# EAGLE design obd2can (EAGLE 7.2.0)
DESCRIPTION: microOBD 200 OBD-II Module; HW_REV: 1.4; PCB_REV: C; PCB_SPEC1: Layer Count: 4; PCB_SPEC2: Size: 1.3" x 0.59"; PCB_SPEC3: Finish Thickness: 0.049" - 0.052"; PCB_SPEC4: Copper Weight: 1oz; TITLE: STM1120

## Sheet 1 of 4
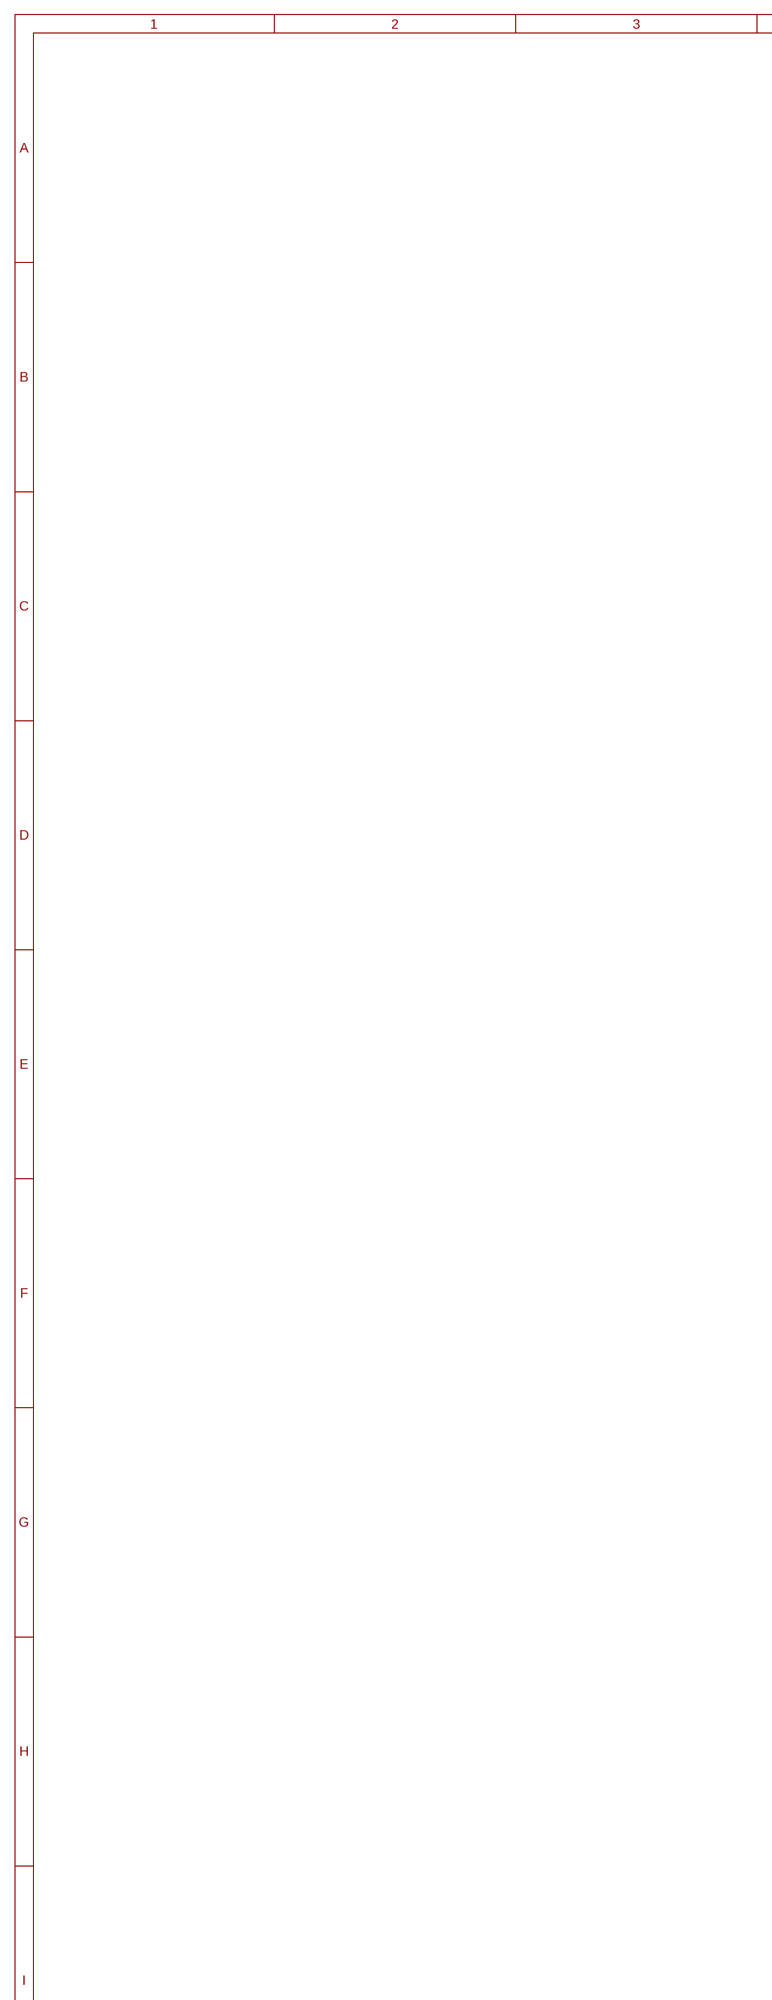
[diagram p0: schematic, sheet 1, part 1 of 2]
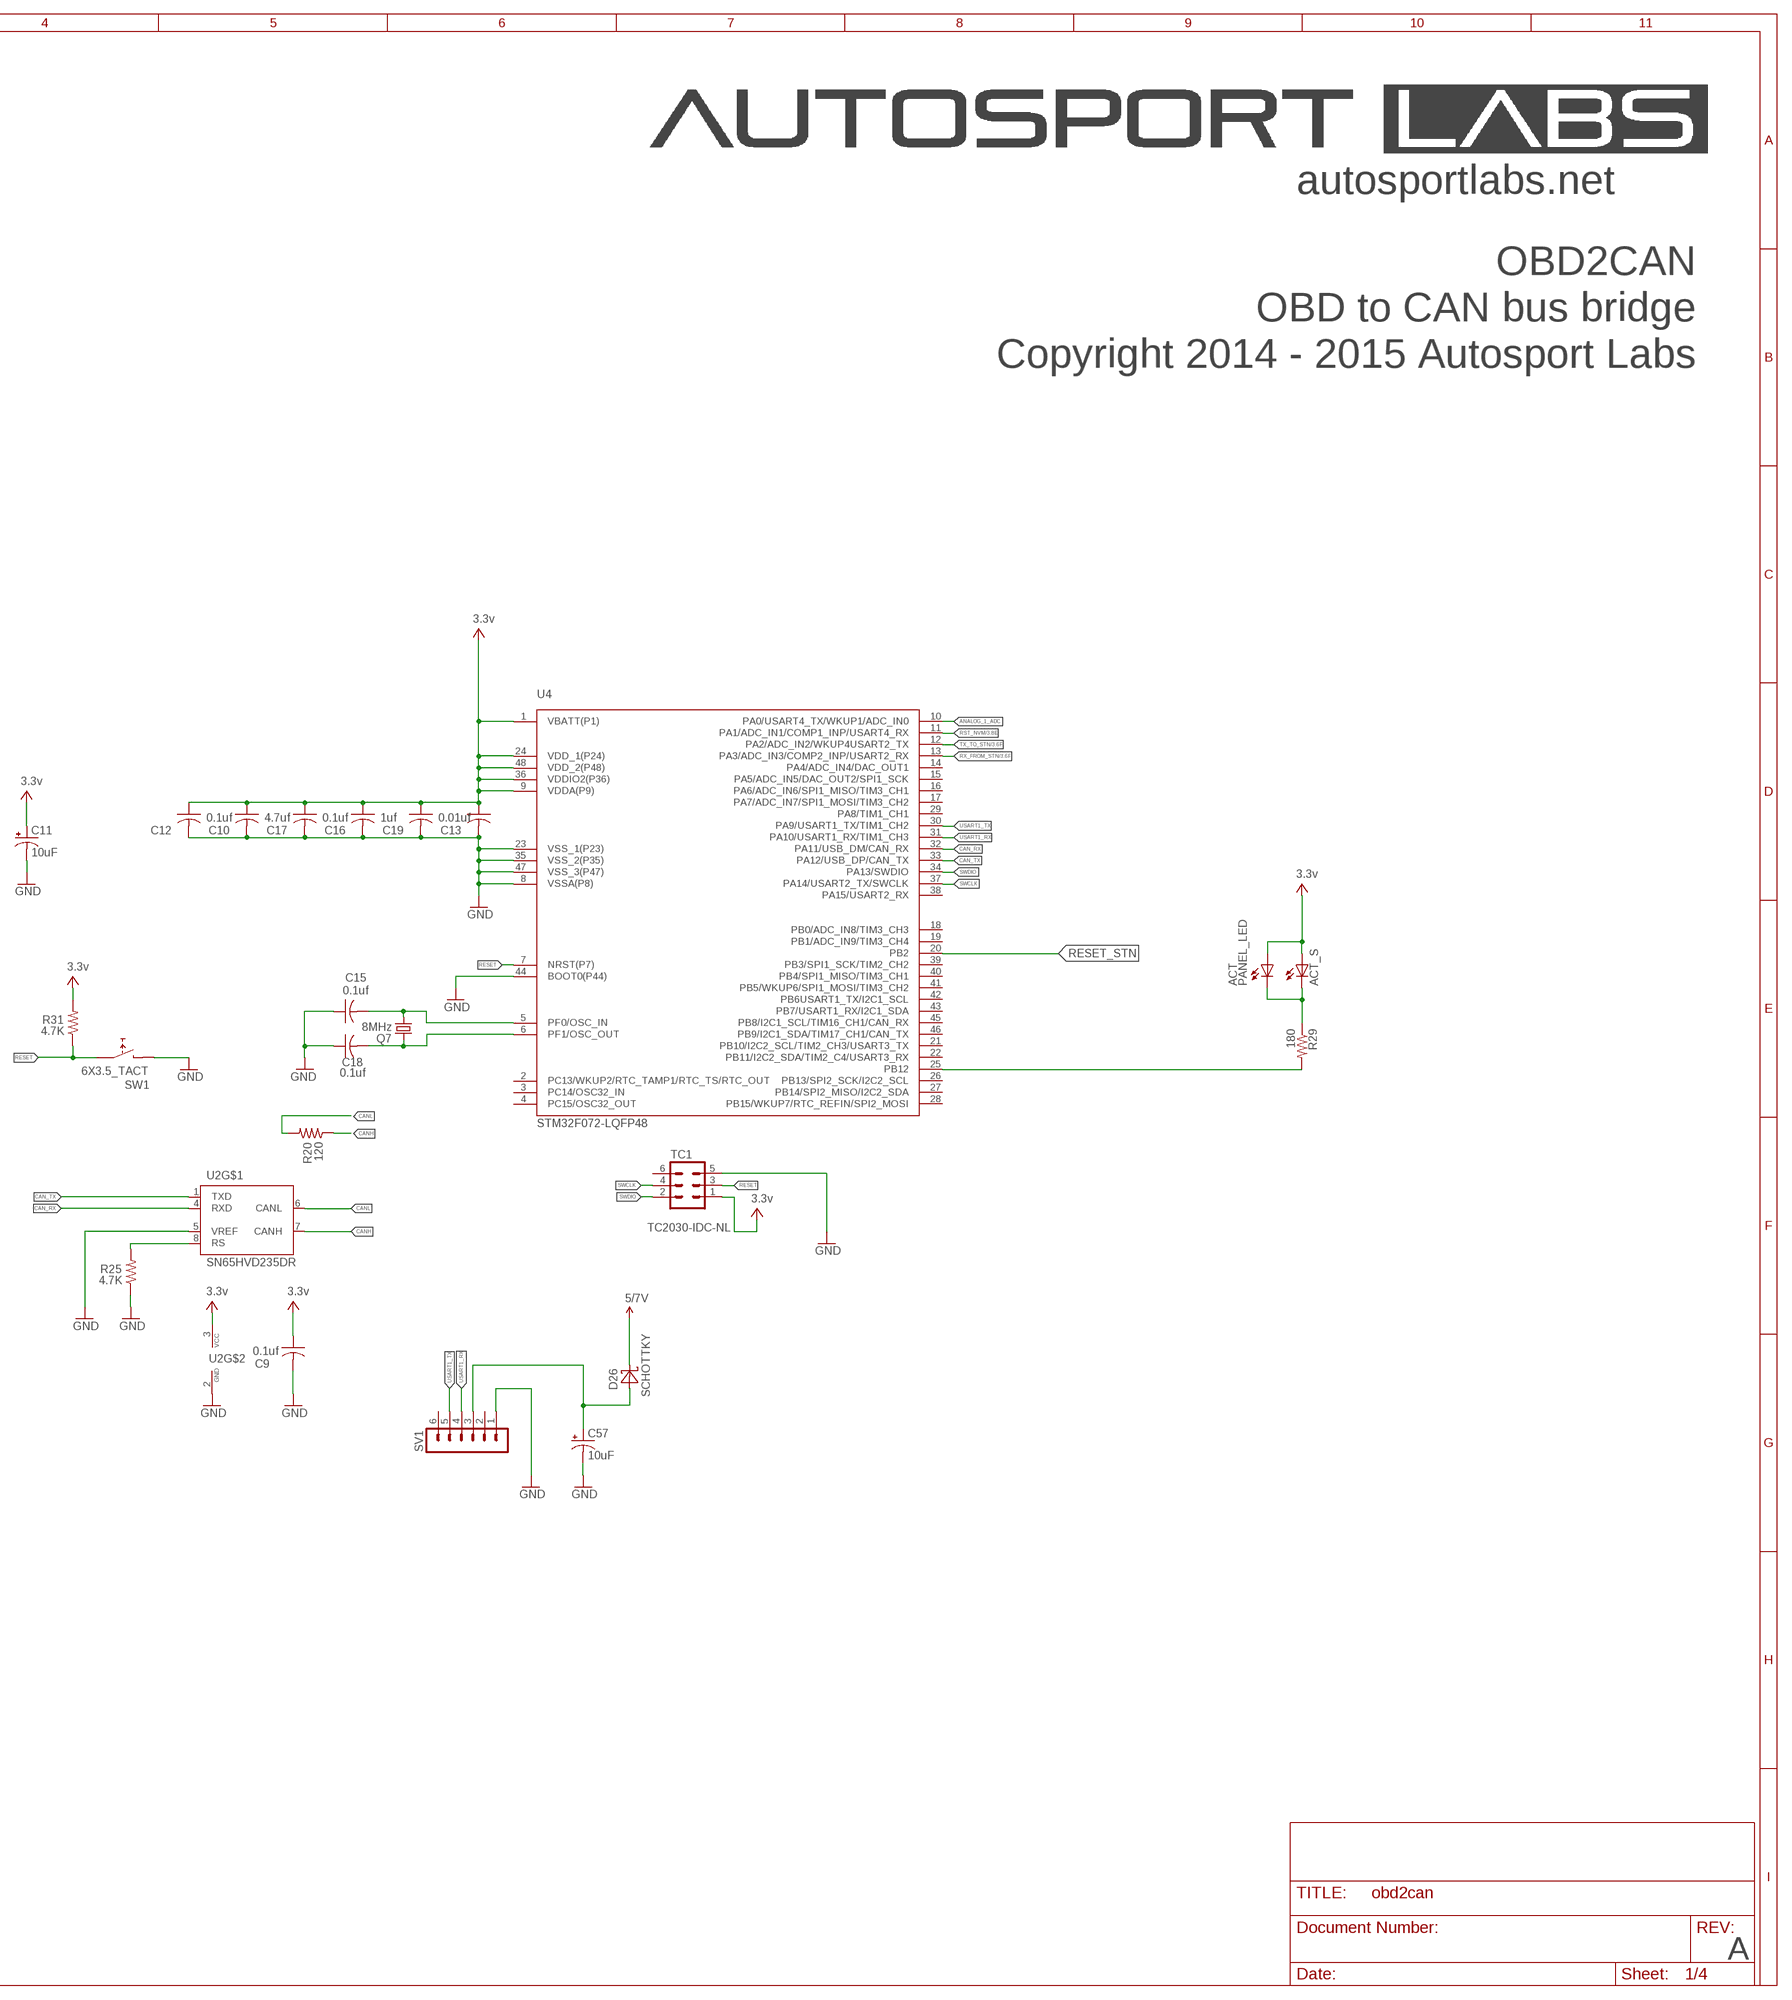
[diagram p1: schematic, sheet 1, part 2 of 2]

### Parts
ACT  PANEL_LED  [RIGHTANGLE_CML_5323F5]
ACT_S  LEDCHIPLED_0603  [CHIPLED_0603]
C9  0.1uf  C-USC0603K  [C0603K]
C10  0.1uf  C-USC0603K  [C0603K]
C11  10uF  CPOL-USSMCA  [SMC_A]
C12  4.7uf  C-USC0603K  [C0603K]
C13  0.01uf  C-USC0603K  [C0603K]
C15  0.1uf  C-USC0603K  [C0603K]
C16  0.1uf  C-USC0603K  [C0603K]
C17  4.7uf  C-USC0603K  [C0603K]
C18  0.1uf  C-USC0603K  [C0603K]
C19  1uf  C-USC0603K  [C0603K]
C57  10uF  CPOL-USSMCA  [SMC_A]
D26  SCHOTTKY  [SMA]
Q7  8MHz  CRYSTAL5X3  [CRYSTAL-SMD-5X3]
R20  120  R-US_R0603  [R0603]
R25  4.7K  R-US_R0603  [R0603]
R29  180  RESISTOR0402-RES  [0402-RES]
R31  4.7K  R-US_R0603  [R0603]
SV1  MA06-1  [MA06-1]
SW1  6X3.5_TACT  [TACT_6X3.5]
TC1  TC2030-IDC-NL  [TC2030-IDC-NL]
U2  SN65HVD235DR  MCP2551SO8  [SO08]
U4  STM32F072-LQFP48  [LQFP48]

### Nets
ANALOG_1_ADC: U4.10(PA0/USART4_TX/WKUP1/ADC_IN0)
CAN_RX: U2.4(RXD) U4.32(PA11/USB_DM/CAN_RX)
CAN_TX: U2.1(TXD) U4.33(PA12/USB_DP/CAN_TX)
CANH: R20.1 U2.7(CANH) ; also sheet 2
CANL: R20.2 U2.6(CANL) ; also sheet 2
GND: C9.2 C10.2 C11.- C12.2 C13.2 C15.1 C16.2 C17.2 C18.1 C19.2 C57.- R25.1 SV1.1 SW1.P$2 TC1.5 U2.2(GND) U2.5(VREF) U4.8(VSSA(P8)) U4.23(VSS_1(P23)) U4.35(VSS_2(P35)) U4.44(BOOT0(P44)) U4.47(VSS_3(P47)) ; also sheet 2,3,4
GND1: ACT.C ACT_S.C R29.1
N$11: R29.2 U4.25(PB12)
N$15: R25.2 U2.8(RS)
N$40: C18.2 Q7.3 U4.6(PF1/OSC_OUT)
N$42: C15.2 Q7.1 U4.5(PF0/OSC_IN)
RESET: R31.1 SW1.P$1 TC1.3 U4.7(NRST(P7))
RESET_STN: U4.20(PB2) ; also sheet 3
RST_NVM: U4.11(PA1/ADC_IN1/COMP1_INP/USART4_RX) ; also sheet 3
RX_FROM_STN: U4.13(PA3/ADC_IN3/COMP2_INP/USART2_RX) ; also sheet 3
SWCLK: TC1.4 U4.37(PA14/USART2_TX/SWCLK)
SWDIO: TC1.2 U4.34(PA13/SWDIO)
TX_TO_STN: U4.12(PA2/ADC_IN2/WKUP4USART2_TX) ; also sheet 3
USART1_RX: SV1.4 U4.31(PA10/USART1_RX/TIM1_CH3)
USART1_TX: SV1.5 U4.30(PA9/USART1_TX/TIM1_CH2)
V+: ACT.A ACT_S.A C9.1 C10.1 C11.+ C12.1 C13.1 C16.1 C17.1 C19.1 R31.2 TC1.1 U2.3(VCC) U4.1(VBATT(P1)) U4.9(VDDA(P9)) U4.24(VDD_1(P24)) U4.36(VDDIO2(P36)) U4.48(VDD_2(P48)) ; supply symbol labelled 3.3v ; also sheet 2,3,4
VBUS: C57.+ D26.A SV1.3
VCC: D26.C ; supply symbol labelled 5/7V ; also sheet 2,4
Unconnected: SV1.2 SV1.6 TC1.6 U4.2(PC13/WKUP2/RTC_TAMP1/RTC_TS/RTC_OUT) U4.3(PC14/OSC32_IN) U4.4(PC15/OSC32_OUT) U4.14(PA4/ADC_IN4/DAC_OUT1) U4.15(PA5/ADC_IN5/DAC_OUT2/SPI1_SCK) U4.16(PA6/ADC_IN6/SPI1_MISO/TIM3_CH1) U4.17(PA7/ADC_IN7/SPI1_MOSI/TIM3_CH2) U4.18(PB0/ADC_IN8/TIM3_CH3) U4.19(PB1/ADC_IN9/TIM3_CH4) U4.21(PB10/I2C2_SCL/TIM2_CH3/USART3_TX) U4.22(PB11/I2C2_SDA/TIM2_C4/USART3_RX) U4.26(PB13/SPI2_SCK/I2C2_SCL) U4.27(PB14/SPI2_MISO/I2C2_SDA) U4.28(PB15/WKUP7/RTC_REFIN/SPI2_MOSI) U4.29(PA8/TIM1_CH1) U4.38(PA15/USART2_RX) U4.39(PB3/SPI1_SCK/TIM2_CH2) U4.40(PB4/SPI1_MISO/TIM3_CH1) U4.41(PB5/WKUP6/SPI1_MOSI/TIM3_CH2) U4.42(PB6USART1_TX/I2C1_SCL) U4.43(PB7/USART1_RX/I2C1_SDA) U4.45(PB8/I2C1_SCL/TIM16_CH1/CAN_RX) U4.46(PB9/I2C1_SDA/TIM17_CH1/CAN_TX)

### Notes on the sheet
- autosportlabs.net
- OBD2CAN
- OBD to CAN bus bridge
- Copyright 2014 - 2015 Autosport Labs
- A

## Sheet 2 of 4
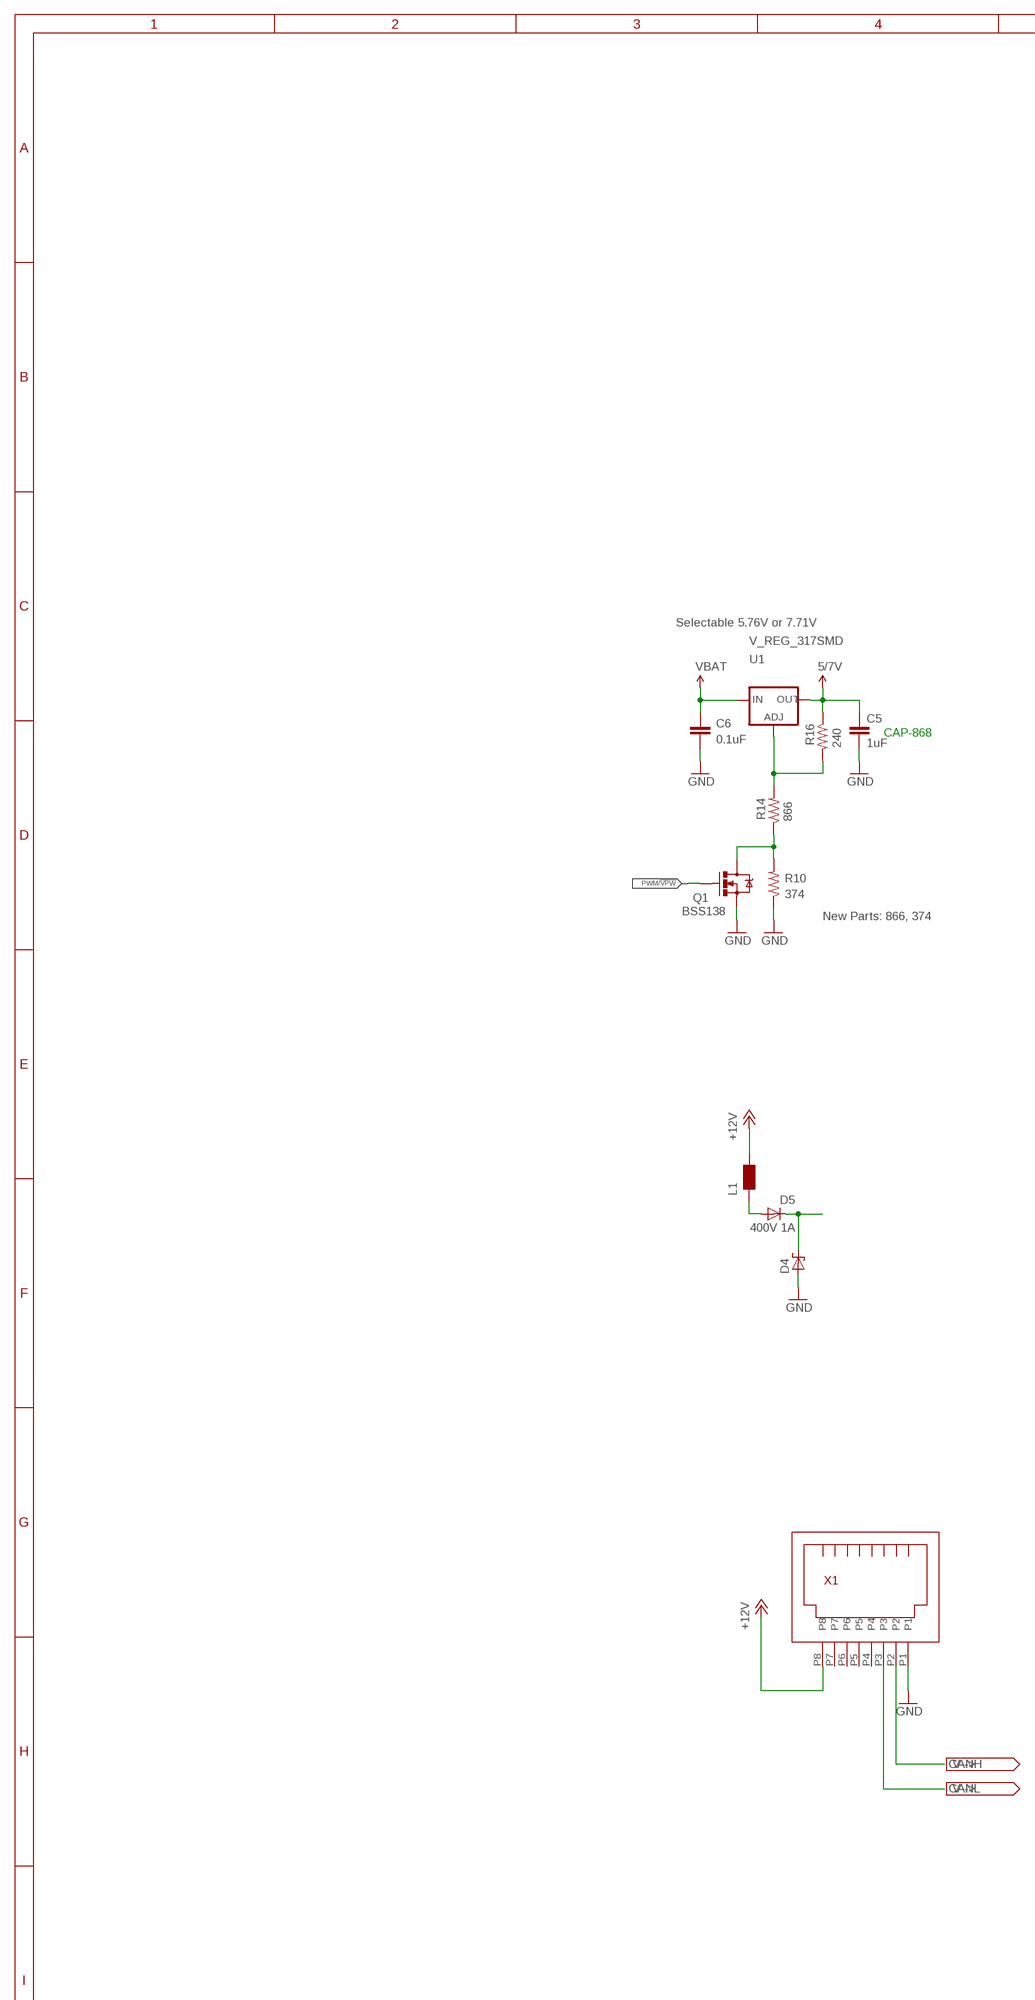
[diagram p2: schematic, sheet 2, part 1 of 2]
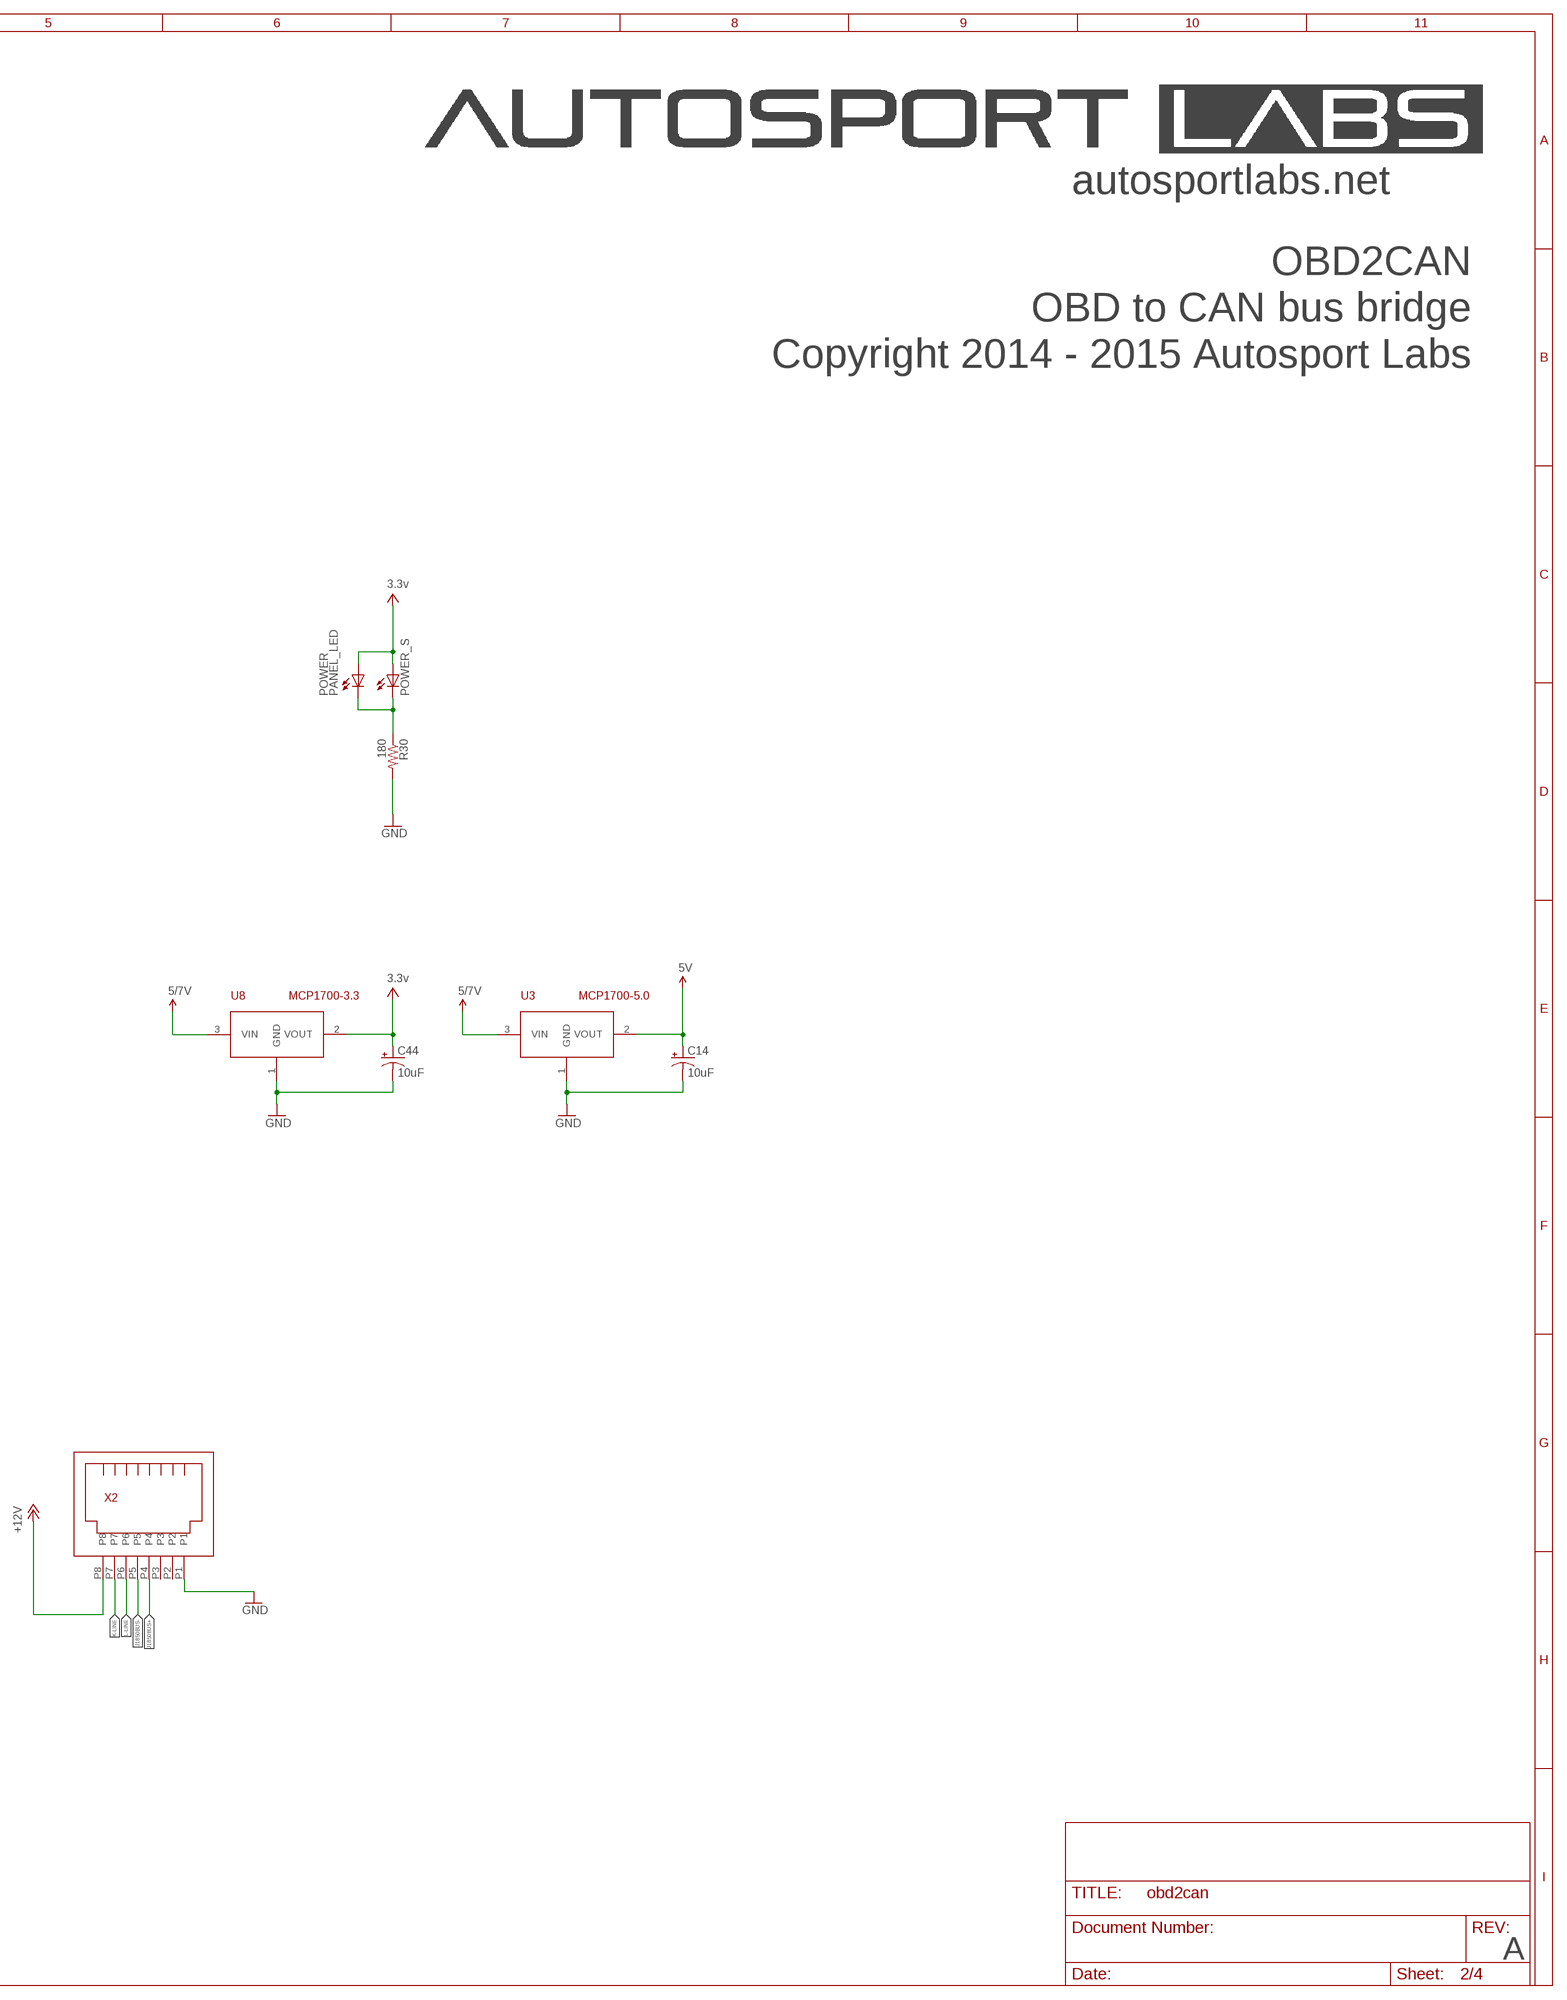
[diagram p3: schematic, sheet 2, part 2 of 2]

### Parts
C5  1uF  CAP0402-CAP  [0402-CAP]
C6  0.1uF  CAP0402-CAP  [0402-CAP]
C14  10uF  CPOL-USSMCA  [SMC_A]
C44  10uF  CPOL-USSMCA  [SMC_A]
D4  SCHOTTKY-DIODESMC  [SMC]
D5  400V 1A  DIODE1  [SMA]
L1  WE-CBF_1812  [1812]
POWER  PANEL_LED  [RIGHTANGLE_CML_5323F5]
POWER_S  LEDCHIPLED_0603  [CHIPLED_0603]
Q1  BSS138  MOSFET-NCHANNELSMD  [SOT23-3]
R10  374  RESISTOR0402-RES  [0402-RES]
R14  866  RESISTOR0402-RES  [0402-RES]
R16  240  RESISTOR0402-RES  [0402-RES]
R30  180  RESISTOR0402-RES  [0402-RES]
U1  V_REG_317SMD  [SOT223]
U3  MCP1700-5.0  MCP1700  [SOT-23]
U8  MCP1700-3.3  MCP1700  [SOT-23]
X1  RJ45_RIGHT_ANGLEMOLEX_95001-2881  [RJ45_RIGHT_ANGLE_MOLEX_95001-2881]
X2  RJ45_RIGHT_ANGLEMOLEX_95001-2881  [RJ45_RIGHT_ANGLE_MOLEX_95001-2881]

### Nets
5V: C14.+ U3.2(VOUT) ; also sheet 4
+12V: L1.2 X1.P8 X2.P8 ; also sheet 3
CANH: X1.P2 ; also sheet 1
CANL: X1.P3 ; also sheet 1
GND: C5.2 C6.2 C14.- C44.- D4.A Q1.2(S) R10.1 R30.2 U3.1(GND) U8.1(GND) X1.P1 X2.P1 ; also sheet 1,3,4
GND2: POWER.C POWER_S.C R30.1
J1850BUS+: X2.P4 ; also sheet 4
J1850BUS-: X2.P5 ; also sheet 4
K-LINE: X2.P7 ; also sheet 4
L-LINE: X2.P6 ; also sheet 4
N$8: R14.2 R16.2 U1.1(ADJ)
N$22: Q1.3(D) R10.2 R14.1
N$50: D5.A L1.1
PWM/!VPW: Q1.1(G) ; also sheet 3
SAFE12V: C6.1 D4.C D5.C U1.3(IN) ; supply symbol labelled VBAT ; also sheet 4
V+: C44.+ POWER.A POWER_S.A U8.2(VOUT) ; supply symbol labelled 3.3v ; also sheet 1,3,4
VCC: C5.1 R16.1 U1.2(OUT) U3.3(VIN) U8.3(VIN) ; supply symbol labelled 5/7V ; also sheet 1,4
Unconnected: X1.P4 X1.P5 X1.P6 X1.P7 X2.P2 X2.P3

### Notes on the sheet
- autosportlabs.net
- OBD2CAN
- OBD to CAN bus bridge
- Copyright 2014 - 2015 Autosport Labs
- Selectable 5.76V or 7.71V
- CAP-868
- New Parts: 866, 374
- A

## Sheet 3 of 4
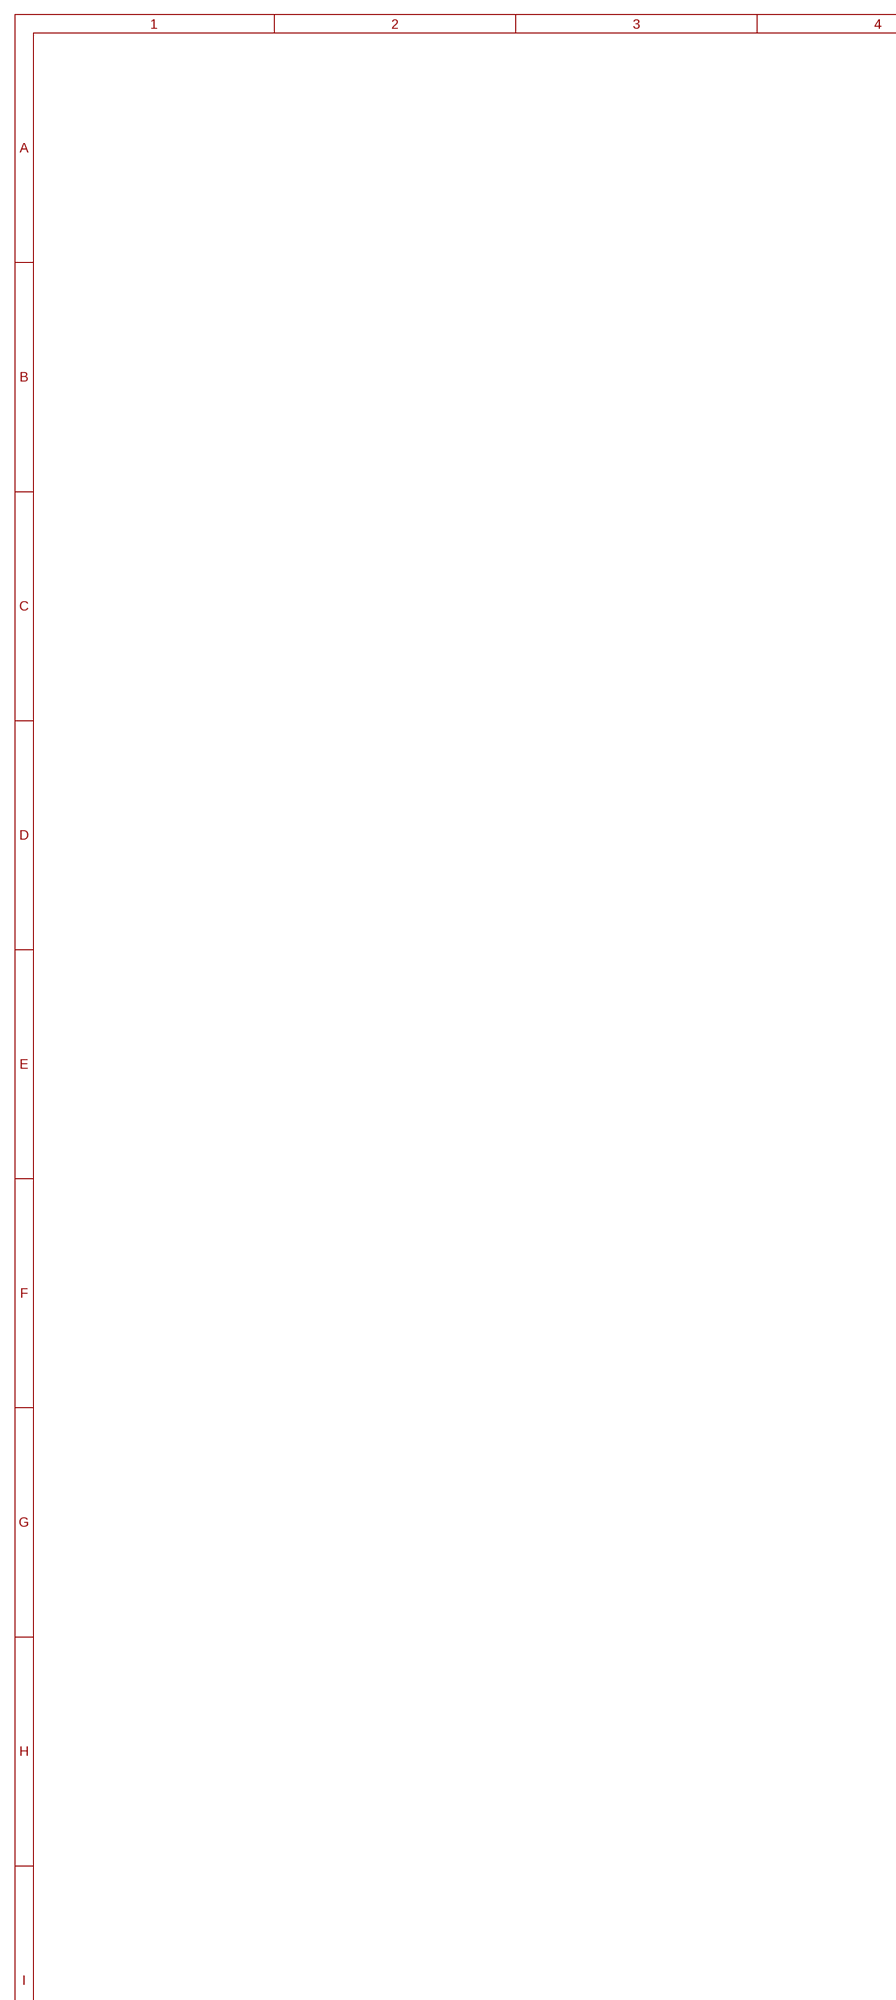
[diagram p4: schematic, sheet 3, part 1 of 2]
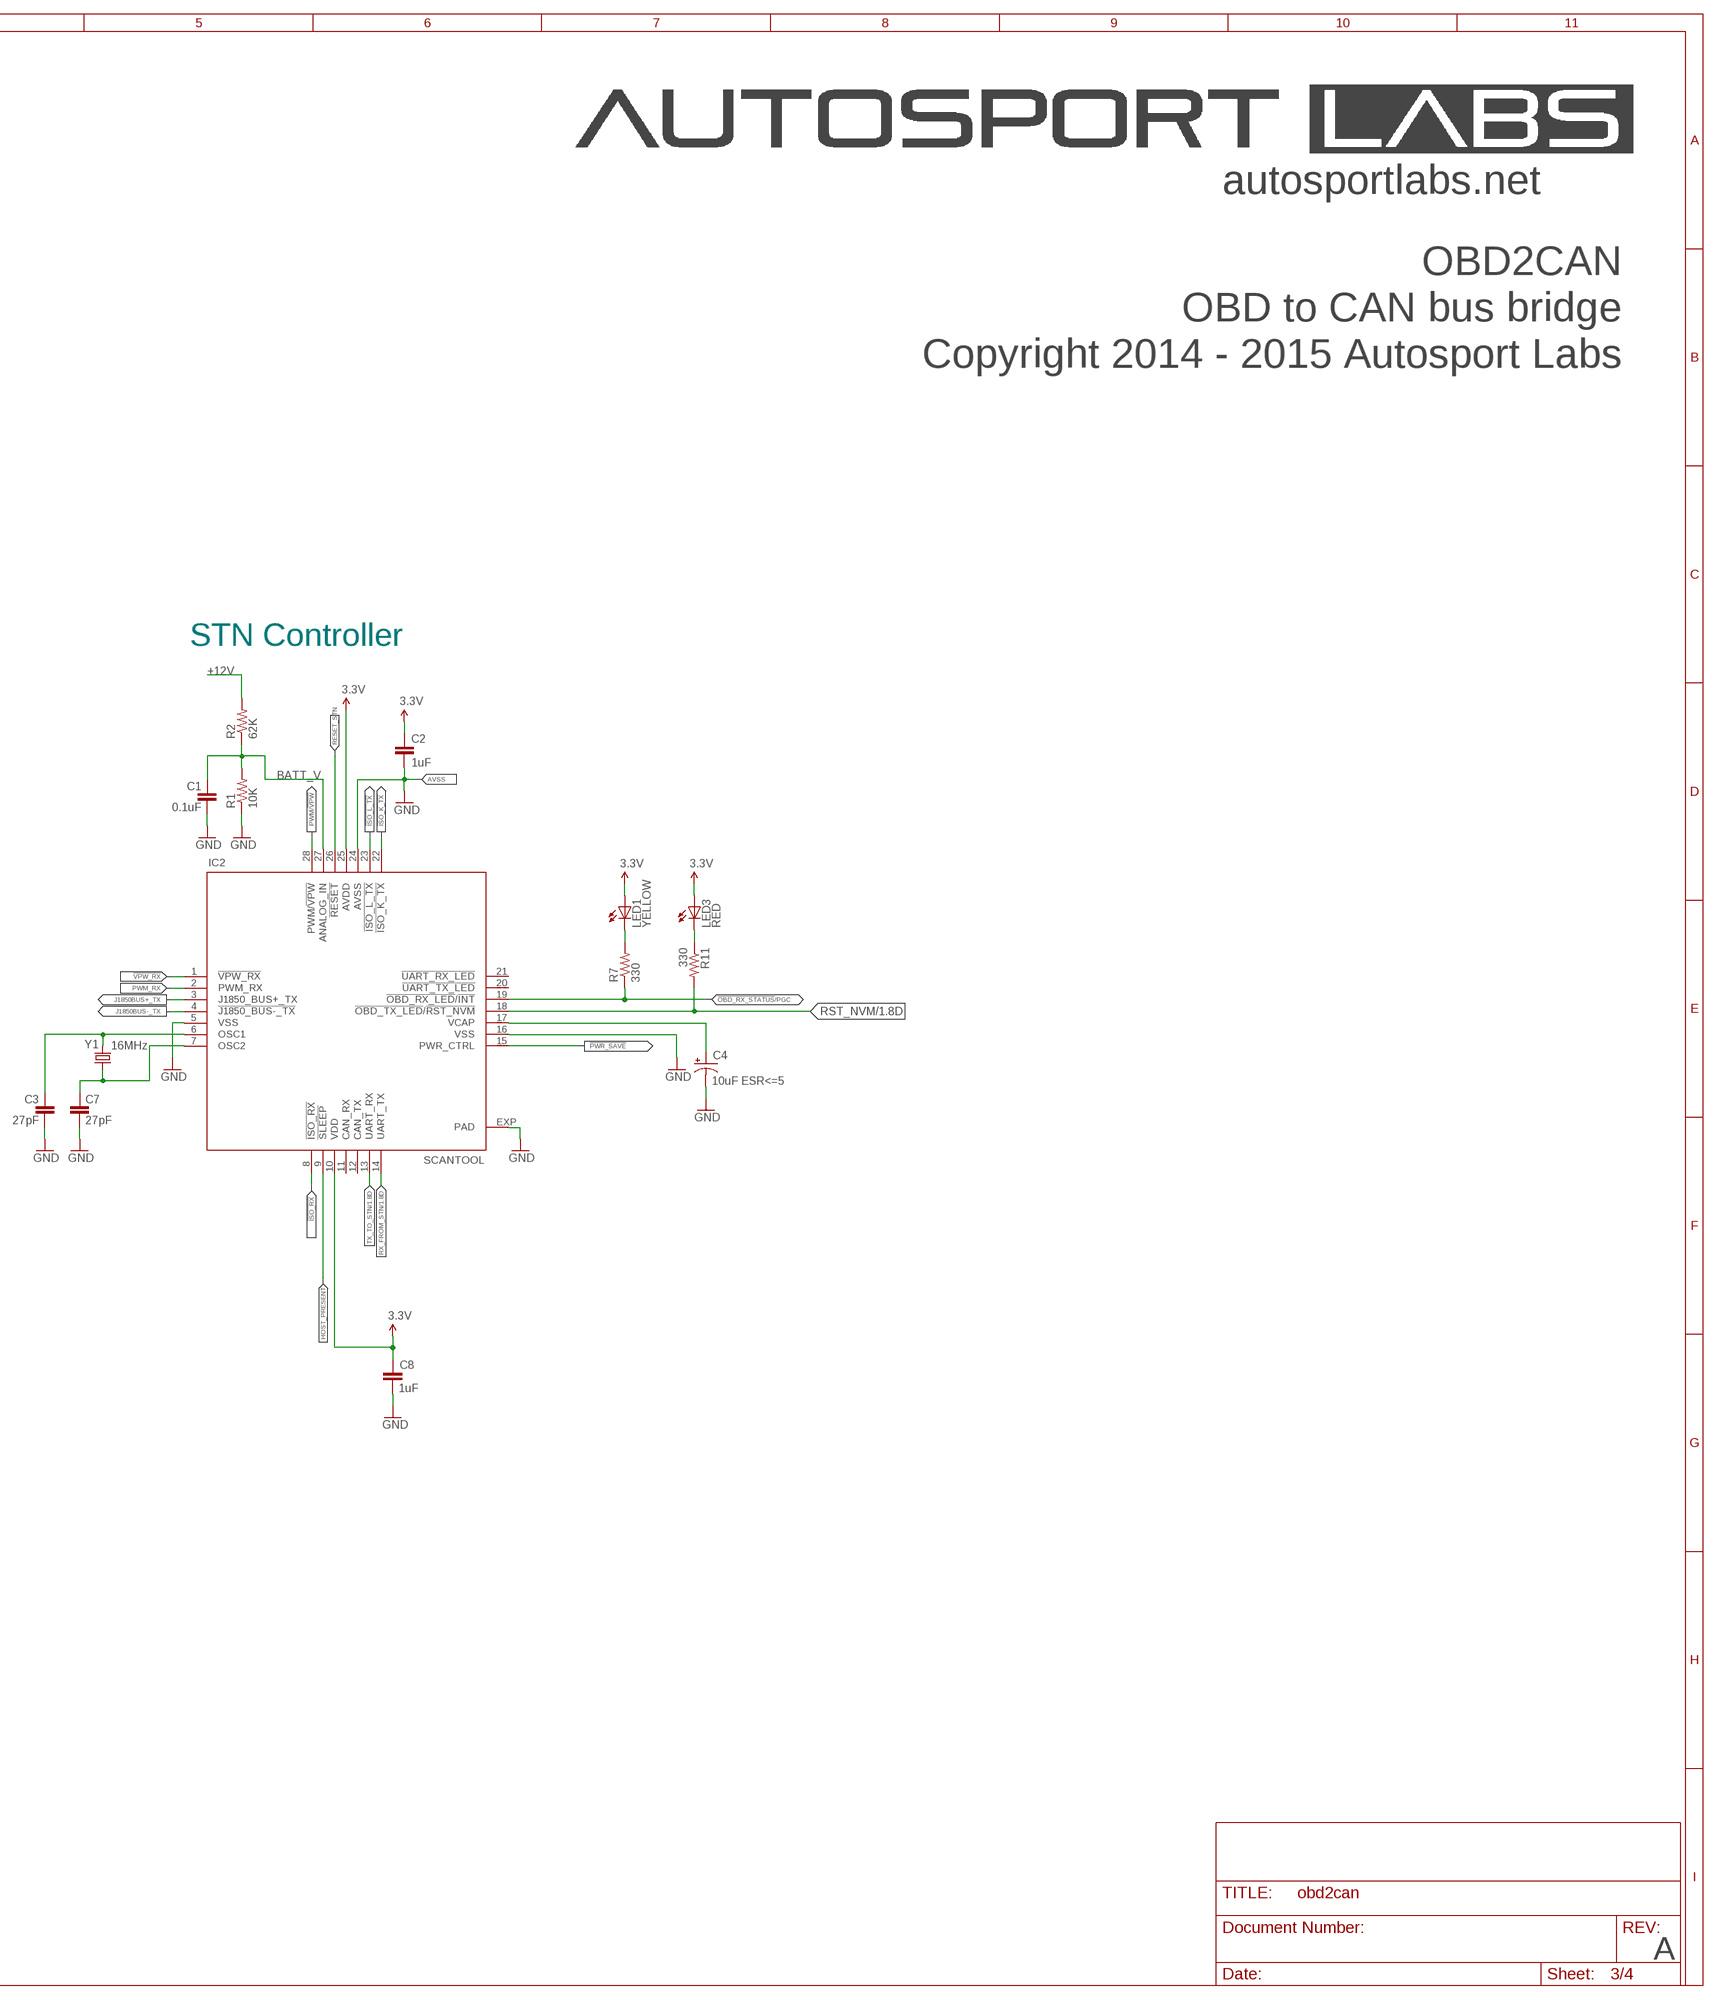
[diagram p5: schematic, sheet 3, part 2 of 2]

### Parts
C1  0.1uF  CAP0402-CAP  [0402-CAP]
C2  1uF  CAP0402-CAP  [0402-CAP]
C3  27pF  CAP0402-CAP  [0402-CAP]
C4  10uF ESR<=5  CAP_POL1206  [EIA3216]
C7  27pF  CAP0402-CAP  [0402-CAP]
C8  1uF  CAP0402-CAP  [0402-CAP]
IC2  SCANTOOL  [_STN_SCANTOOL_QFN-28-S]
LED1  YELLOW  LED0603  [LED-0603]
LED3  RED  LED0603  [LED-0603]
R1  10K  RESISTOR0402-RES  [0402-RES]
R2  62K  RESISTOR0402-RES  [0402-RES]
R7  330  RESISTOR0402-RES  [0402-RES]
R11  330  RESISTOR0402-RES  [0402-RES]
Y1  16MHz  CRYSTAL5X3  [CRYSTAL-SMD-5X3]

### Nets
!ISO_K_TX: IC2.22(!ISO_K_TX) ; also sheet 4
!ISO_L_TX: IC2.23(!ISO_L_TX) ; also sheet 4
!ISO_RX: IC2.8(!ISO_RX) ; also sheet 4
!OBD_RX_STATUS!/PGC: IC2.19(!OBD_RX_LED!/!INT) R7.1
!PWR_SAVE: IC2.15(PWR_CTRL)
!VPW_RX: IC2.1(!VPW_RX) ; also sheet 4
+12V: R2.2 ; also sheet 2
BATT_V: C1.1 IC2.27(ANALOG_IN) R1.2 R2.1
GND: C1.2 C2.2 C3.2 C4.C(-) C7.2 C8.2 IC2.5(VSS) IC2.16(VSS) IC2.24(AVSS) IC2.EXP(PAD) R1.1 ; also sheet 1,2,4
HOST_PRESENT: IC2.9(!SLEEP)
J1850BUS+_TX: IC2.3(J1850_BUS+_TX) ; also sheet 4
J1850BUS-_TX: IC2.4(!J1850_BUS-_TX) ; also sheet 4
N$26: C4.A(+) IC2.17(VCAP)
N$30: LED1.C R7.2
N$31: LED3.C R11.1
OSC1: C3.1 IC2.6(OSC1) Y1.3
OSC2: C7.1 IC2.7(OSC2) Y1.1
PWM/!VPW: IC2.28(PWM/!VPW) ; also sheet 2
PWM_RX: IC2.2(PWM_RX) ; also sheet 4
RESET_STN: IC2.26(!RESET) ; also sheet 1
RST_NVM: IC2.18(!OBD_TX_LED!/!RST_NVM) R11.2 ; also sheet 1
RX_FROM_STN: IC2.14(UART_TX) ; also sheet 1
TX_TO_STN: IC2.13(UART_RX) ; also sheet 1
V+: C2.1 C8.1 IC2.10(VDD) IC2.25(AVDD) LED1.A LED3.A ; supply symbol labelled 3.3V ; also sheet 1,2,4
Unconnected: IC2.11(CAN_RX) IC2.12(CAN_TX) IC2.20(!UART_TX_LED) IC2.21(!UART_RX_LED)

### Notes on the sheet
- autosportlabs.net
- OBD2CAN
- OBD to CAN bus bridge
- Copyright 2014 - 2015 Autosport Labs
- STN Controller
- AVSS
- A

## Sheet 4 of 4
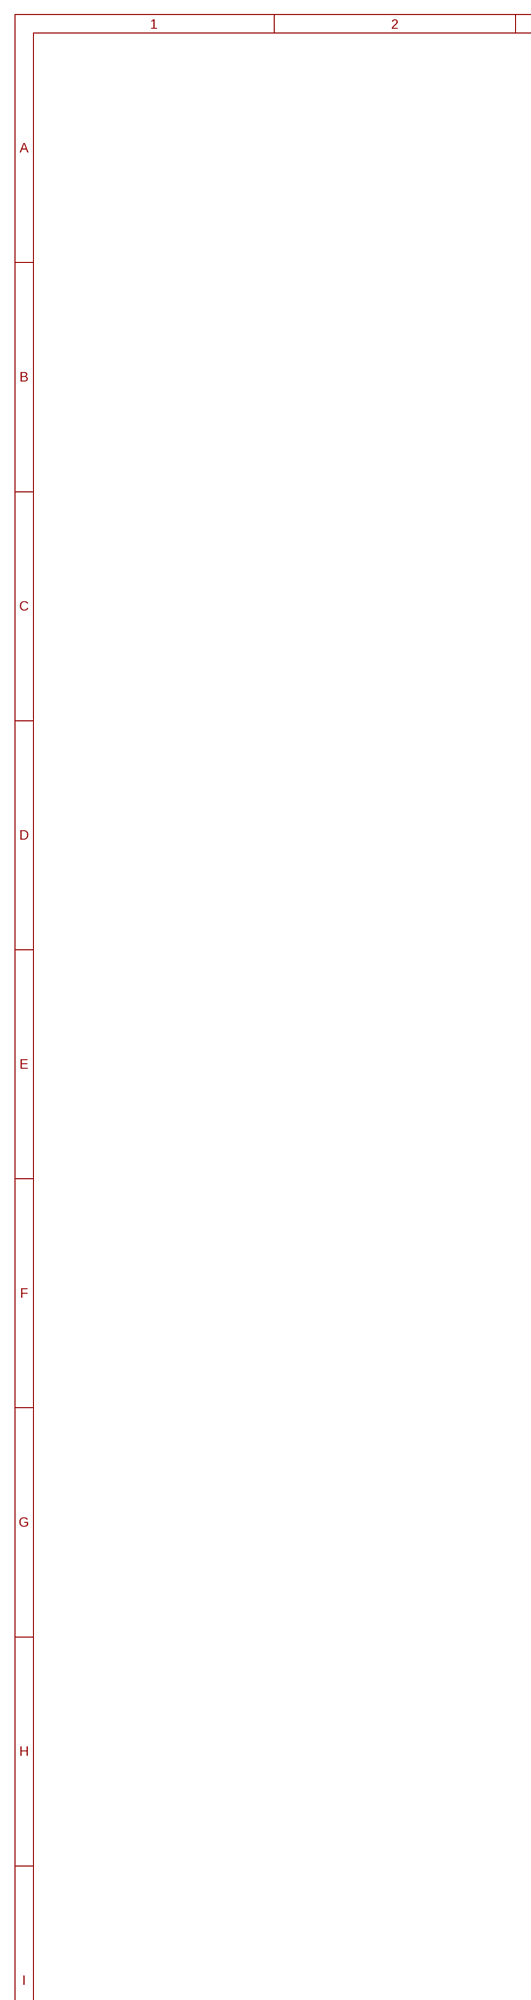
[diagram p6: schematic, sheet 4, part 1 of 2]
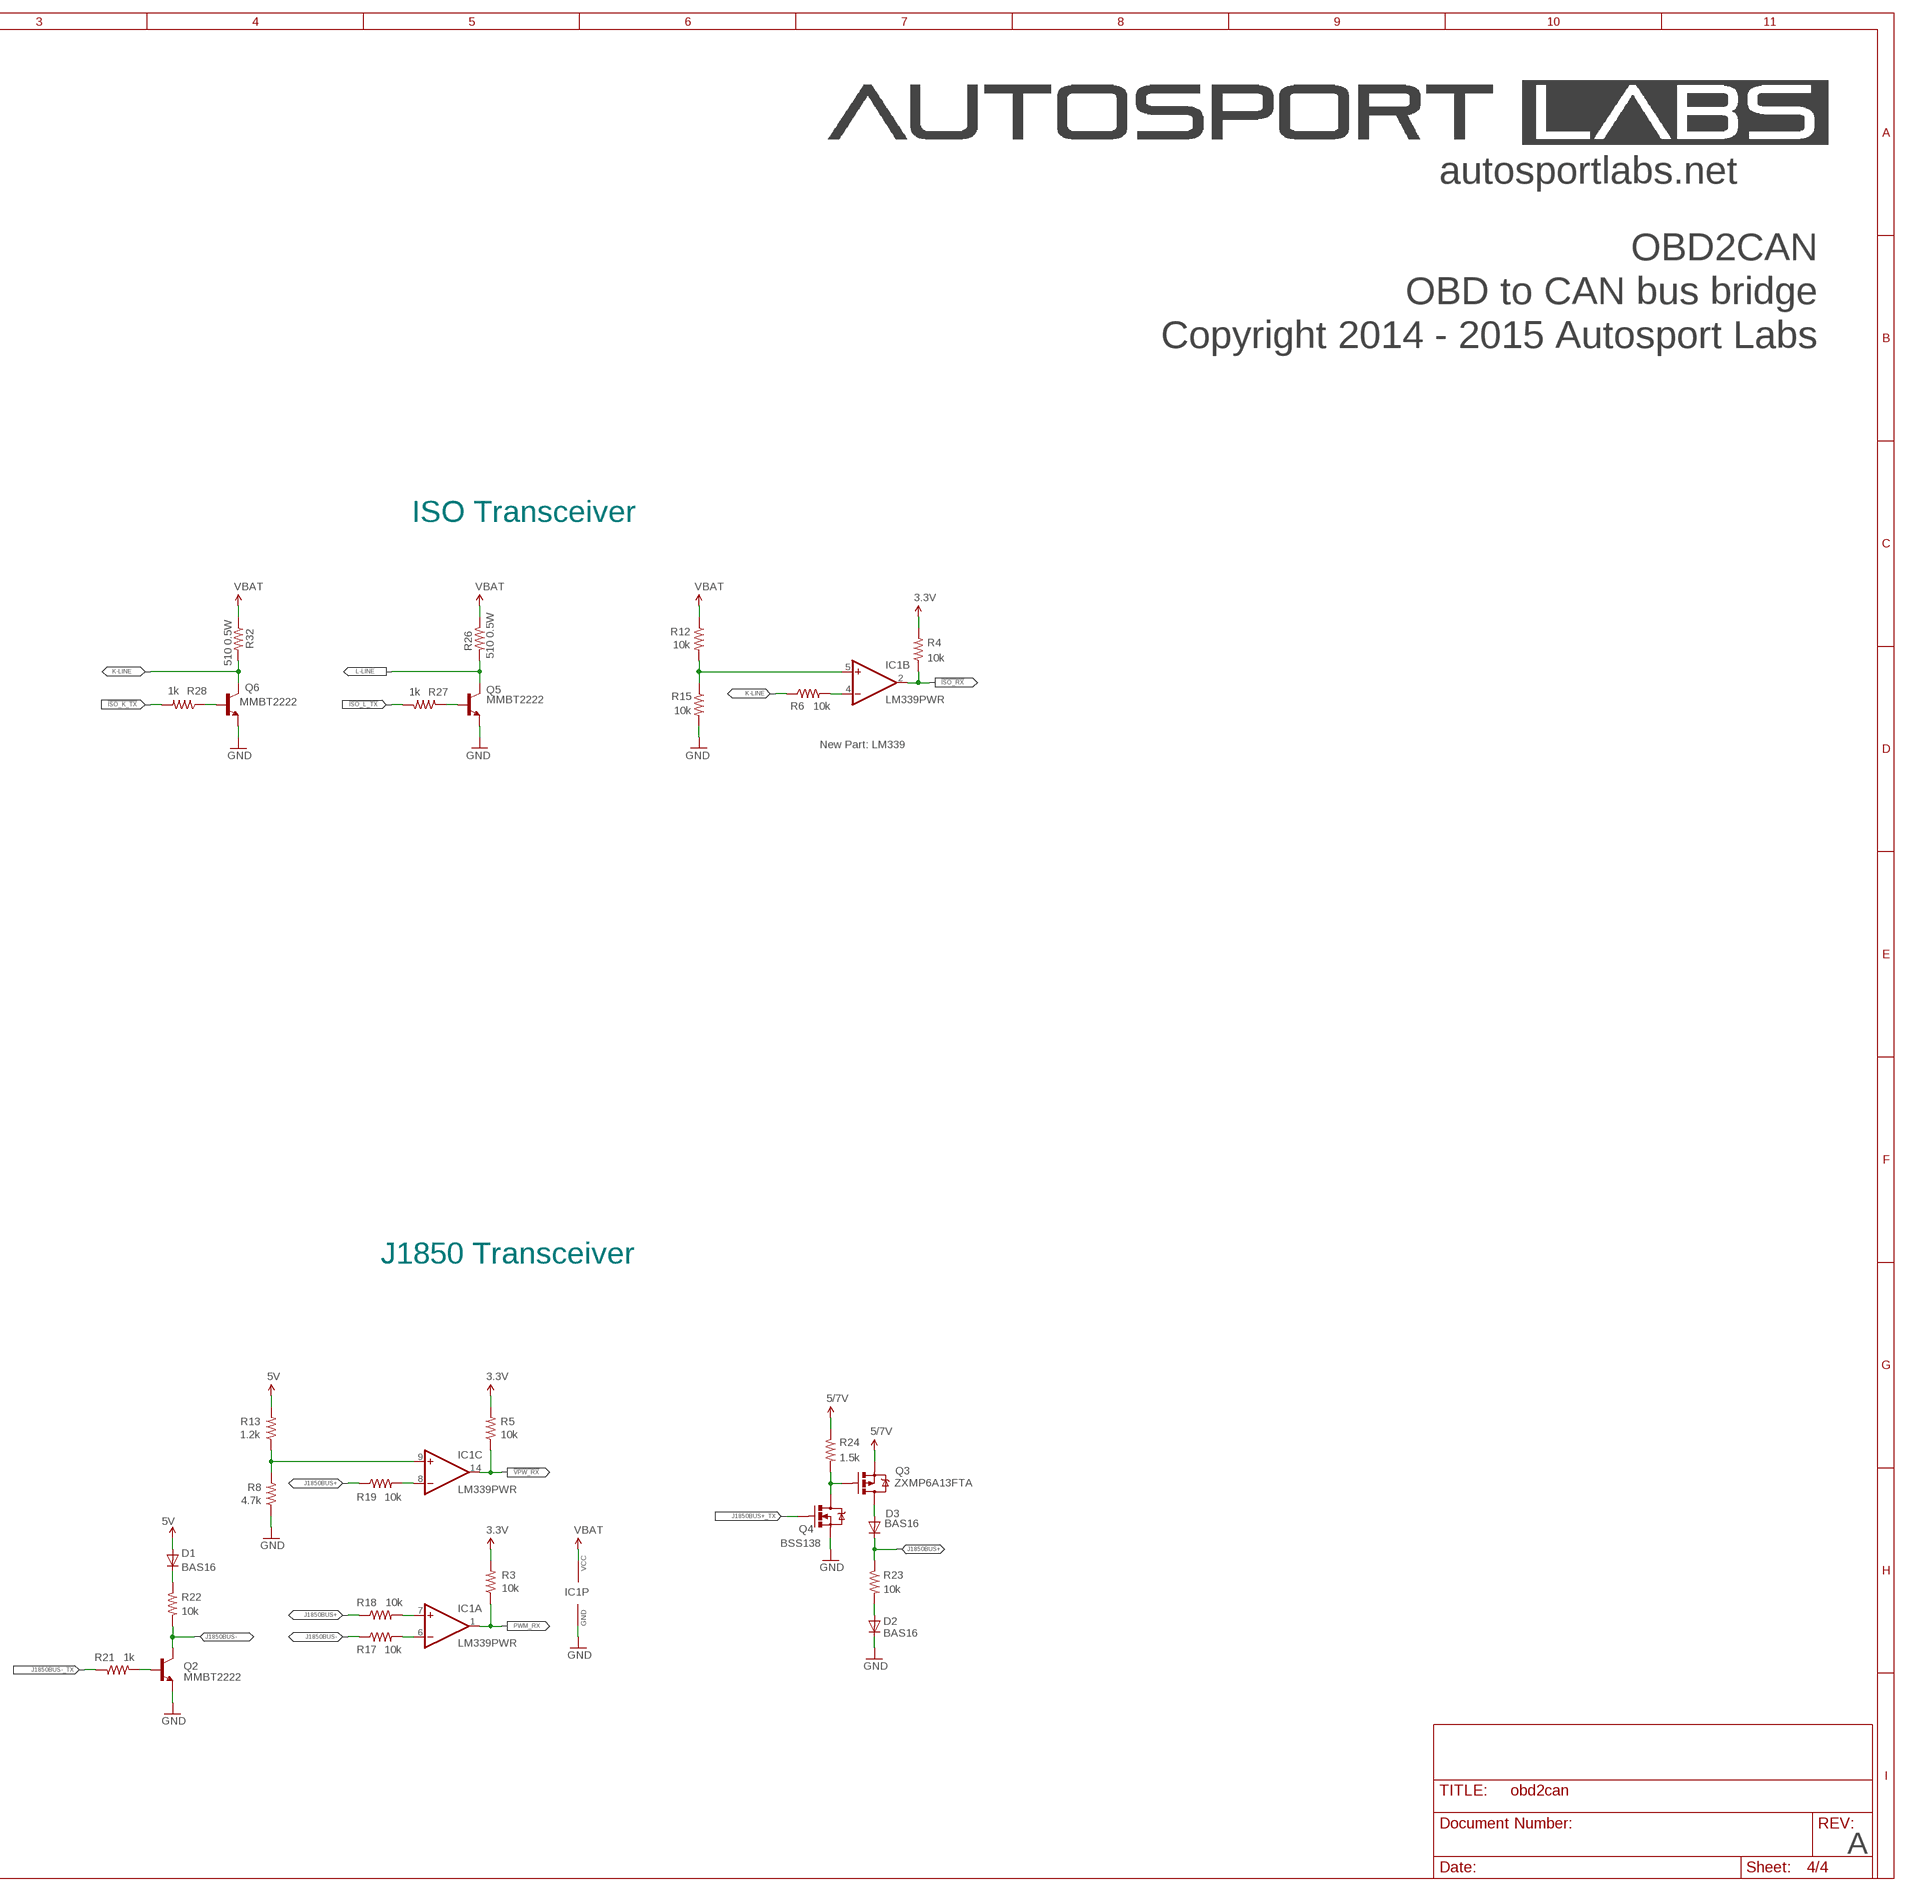
[diagram p7: schematic, sheet 4, part 2 of 2]

### Parts
D1  BAS16  DIODESOD  [SOD-323]
D2  BAS16  DIODESOD  [SOD-323]
D3  BAS16  DIODESOD  [SOD-323]
IC1  LM339PWR  [TSSOP-14]
Q2  MMBT2222  TRANSISTOR_NPNSOT23-3  [SOT23-3]
Q3  ZXMP6A13FTA  MOSFET-PCHANNEL  [SOT23]
Q4  BSS138  MOSFET-NCHANNELSMD  [SOT23-3]
Q5  MMBT2222  TRANSISTOR_NPNSOT23-3  [SOT23-3]
Q6  MMBT2222  TRANSISTOR_NPNSOT23-3  [SOT23-3]
R3  10k  RESISTOR0402-RES  [0402-RES]
R4  10k  RESISTOR0402-RES  [0402-RES]
R5  10k  RESISTOR0402-RES  [0402-RES]
R6  10k  RESISTOR0402-RES  [0402-RES]
R8  4.7k  RESISTOR0402-RES  [0402-RES]
R12  10k  RESISTOR0402-RES  [0402-RES]
R13  1.2k  RESISTOR0402-RES  [0402-RES]
R15  10k  RESISTOR0402-RES  [0402-RES]
R17  10k  RESISTOR0402-RES  [0402-RES]
R18  10k  RESISTOR0402-RES  [0402-RES]
R19  10k  RESISTOR0402-RES  [0402-RES]
R21  1k  RESISTOR0402-RES  [0402-RES]
R22  10k  RESISTOR0402-RES  [0402-RES]
R23  10k  RESISTOR0402-RES  [0402-RES]
R24  1.5k  RESISTOR0402-RES  [0402-RES]
R26  510 0.5W  R-US_2010  [2010]
R27  1k  RESISTOR0402-RES  [0402-RES]
R28  1k  RESISTOR0402-RES  [0402-RES]
R32  510 0.5W  R-US_2010  [2010]

### Nets
5V: D1.2(A) R13.2 ; also sheet 2
!ISO_K_TX: R28.2 ; also sheet 3
!ISO_L_TX: R27.2 ; also sheet 3
!ISO_RX: IC1.2(B:OUT) R4.1 ; also sheet 3
!VPW_RX: IC1.14(C:OUT) R5.1 ; also sheet 3
GND: D2.1(C) IC1.12(P:GND) Q2.2(E) Q4.2(S) Q5.2(E) Q6.2(E) R8.1 R15.2 ; also sheet 1,2,3
J1850BUS+: D3.1(C) R18.1 R19.1 R23.1 ; also sheet 2
J1850BUS+_TX: Q4.1(G) ; also sheet 3
J1850BUS-: Q2.3(C) R17.1 R22.2 ; also sheet 2
J1850BUS-_TX: R21.1 ; also sheet 3
K-LINE: Q6.3(C) R6.1 R32.2 ; also sheet 2
L-LINE: Q5.3(C) R26.2 ; also sheet 2
N$1: IC1.7(A:+IN) R18.2
N$3: IC1.6(A:-IN) R17.2
N$4: Q6.1(B) R28.1
N$5: Q5.1(B) R27.1
N$6: IC1.5(B:+IN) R12.2 R15.1
N$7: IC1.8(C:-IN) R19.2
N$9: D3.2(A) Q3.3(D)
N$12: IC1.9(C:+IN) R8.2 R13.1
N$13: IC1.4(B:-IN) R6.2
N$14: D1.1(C) R22.1
N$18: Q3.1(G) Q4.3(D) R24.2
N$24: D2.2(A) R23.2
N$25: Q2.1(B) R21.2
PWM_RX: IC1.1(A:OUT) R3.1 ; also sheet 3
SAFE12V: IC1.3(P:VCC) R12.1 R26.1 R32.1 ; supply symbol labelled VBAT ; also sheet 2
V+: R3.2 R4.2 R5.2 ; supply symbol labelled 3.3V ; also sheet 1,2,3
VCC: Q3.2(S) R24.1 ; supply symbol labelled 5/7V ; also sheet 1,2
Unconnected: IC1.10(D:-IN) IC1.11(D:+IN) IC1.13(D:OUT)

### Notes on the sheet
- autosportlabs.net
- OBD2CAN
- OBD to CAN bus bridge
- Copyright 2014 - 2015 Autosport Labs
- ISO Transceiver
- New Part: LM339
- J1850 Transceiver
- A

## Library data of the parts
ACT POWER = LEDs:PANEL_LED
ACT_S POWER_S = led:LED: LED OSRAM: - CHIPLED LG R971, LG N971, LY N971, LG Q971, LY Q971, LO R971, LY R971 LH N974, LH R974 LS Q976, LO Q976, LY Q976 LO Q996 - Hyper CHIPLED LW Q18S LB Q993, LB Q99A, LB R99A - SideLED LS A670, LO A670, LY A670, LG A670, LP A670 LB A673, LV A673, LT A673, LW A673 LH A674 LY A675 LS A676, LA A676, LO A676, LY A676, LW A676 LS A679, LY A679, LG A679 - Hyper Micro SIDELED® LS Y876, LA Y876, LO Y876, LY Y876 LT Y87S - SmartLED LW L88C, LW L88S LB L89C, LB L89S, LG L890 LS L89K, LO L89K, LY L89K LS L896, LA L896, LO L896, LY L896 - TOPLED LS T670, LO T670, LY T670, LG T670, LP T670 LSG T670, LSP T670, LSY T670, LOP T670, LYG T670 LG T671, LOG T671, LSG T671 LB T673, LV T673, LT T673, LW T673 LH T674 LS T676, LA T676, LO T676, LY T676, LB T676, LH T676, LSB T676, LW T676 LB T67C, LV T67C, LT T67C, LS T67K, LO T67K, LY T67K, LW E67C LS E67B, LA E67B, LO E67B, LY E67B, LB E67C, LV E67C, LT E67C LW T67C LS T679, LY T679, LG T679 LS T770, LO T770, LY T770, LG T770, LP T770 LB T773, LV T773, LT T773, LW T773 LH T774 LS E675, LA E675, LY E675, LS T675 LS T776, LA T776, LO T776, LY T776, LB T776 LHGB T686 LT T68C, LB T68C - Hyper Mini TOPLED® LB M676 - Mini TOPLED Santana® LG M470 LS M47K, LO M47K, LY M47K Source: http://www.osram.convergy.de LUXEON: - LUMILED® LXK2-PW12-R00, LXK2-PW12-S00, LXK2-PW14-U00, LXK2-PW14-V00 LXK2-PM12-R00, LXK2-PM12-S00, LXK2-PM14-U00 LXK2-PE12-Q00, LXK2-PE12-R00, LXK2-PE12-S00, LXK2-PE14-T00, LXK2-PE14-U00 LXK2-PB12-K00, LXK2-PB12-L00, LXK2-PB12-M00, LXK2-PB14-N00, LXK2-PB14-P00, LXK2-PB14-Q00 LXK2-PR12-L00, LXK2-PR12-M00, LXK2-PR14-Q00, LXK2-PR14-R00 LXK2-PD12-Q00, LXK2-PD12-R00, LXK2-PD12-S00 LXK2-PH12-R00, LXK2-PH12-S00 LXK2-PL12-P00, LXK2-PL12-Q00, LXK2-PL12-R00 Source: www.luxeon.com KINGBRIGHT: KA-3528ASYC Source: www.kingbright.com
C1-C3 C5-C8 = SparkFun:CAP: Capacitor Standard 0603 ceramic capacitor, and 0.1" leaded capacitor.
C4 = SparkFun:CAP_POL: Capacitor Polarized These are standard SMD and PTH capacitors. Normally 10uF, 47uF, and 100uF in electrolytic and tantalum varieties. Always verify the external diameter of the through hole cap, it varies with capacity, voltage, and manufacturer. The EIA devices should be standard.
C9 C10 C12 C13 C15-C19 = rcl:C-US: CAPACITOR, American symbol
C11 C14 C44 C57 = rcl:CPOL-US: POLARIZED CAPACITOR, American symbol
D1-D3 = SparkFun:DIODE: Diode These are standard reverse protection diodes and small signal diodes. SMA package can handle up to about 1A. SOD-323 can handle about 200mA. What the SOD-323 package when ordering, there are some mfgs out there that are 5-pin packages.
D4 = diode:SCHOTTKY-DIODE: Schottky Diode
D5 = smt_diodes:DIODE
D26 = smt_diodes:SCHOTTKY
IC1 = _stn_logic:LM339PWR: Quad Differential Comparators Based on information from the SLCS006N datasheet from TI (www.ti.com). Change Log Date Author Change July 16, 2008 nick@scantool.net Device created.; DESC: IC, Quad Comparator; MANUF: Texas Instruments; PARTNUM: LM339PWR; SUPPLIER: Digikey:296-6607-1-ND; VALSTAT: PARTNUM
IC2 = SparkFun:SCANTOOL: STN1110 - Multiprotocol OBD II to UART Interpreter, QFN Package Change Log Date Author Change Aug 23, 2010 vit@scantool.net Created device
L1 = wuerth-elektronik:WE-CBF: SMD EMI Suppression Ferrite Beads - excellent anti-EMI properties - low DCR - impedances till 3000 ohms - rated current up to 6 A
LED1 LED3 = SparkFun:LED: LEDs Standard schematic elements and footprints for 5mm, 3mm, 1206, and 0603 sized LEDs. 5mm - Spark Fun Electronics SKU : COM-00529 (and others)
Q1 Q4 = SparkFun:MOSFET-NCHANNEL
Q2 Q5 Q6 = SparkFun:TRANSISTOR_NPN: Transistor NPN BJT configuration in SOT23 package. MMBT2222 is the common NPN we use. Double check BCE configuration again layout.
Q3 = SparkFun:MOSFET-PCHANNEL
Q7 = SparkFun2:CRYSTAL: Crystals Various standard crystals. Proven footprints. Spark Fun Electronics SKU : COM-00534
R1-R8 R10-R19 R21-R24 R27-R30 = SparkFun:RESISTOR: Resistor Basic schematic elements and footprints for 0603, 1206, and PTH resistors.
R20 R25 R31 = rcl:R-US_: RESISTOR, American symbol
R26 R32 = _stn_rcl:R-US: Resistor, US Symbol Change Log Date Author Change November 13, 2006 vit@scantool.net Moved underscore from the end of device name to beginning of variant names. May 27, 2006 vitaliy@scantool.net Added description.; DESC: Resistor; VALSTAT: VAL
SV1 = con-lstb:MA06-1: PIN HEADER; OC_FARNELL: unknown; OC_NEWARK: unknown
SW1 = tactile_switch:6X3.5_TACT
TC1 = TagConnect:TC2030-IDC: Tag-Connect In Circuit Programming & Debug Cable 6 Pin http://www.tag-connect.com
U1 = SparkFun:V_REG_317: Voltage Regulator Standard LM317 adjustable voltage regulator. AOI (Adjust Output Input). Google 'LM317 Calculator' for easy to use app to get the two resistor values needed. 240/720 for 5V output. 240/390 for 3.3V output. Spark Fun Electronics SKU : COM-00527
U2 = can:MCP2551: CAN Tranceiver Microchip
U3 U8 = mcp1700:MCP1700
U4 = stm32f0:STM32F072
X1 X2 = FCI_RJ12:RJ45_RIGHT_ANGLE
Y1 = SparkFun:CRYSTAL: Crystals Various standard crystals. Proven footprints. Spark Fun Electronics SKU : COM-00534

## Board
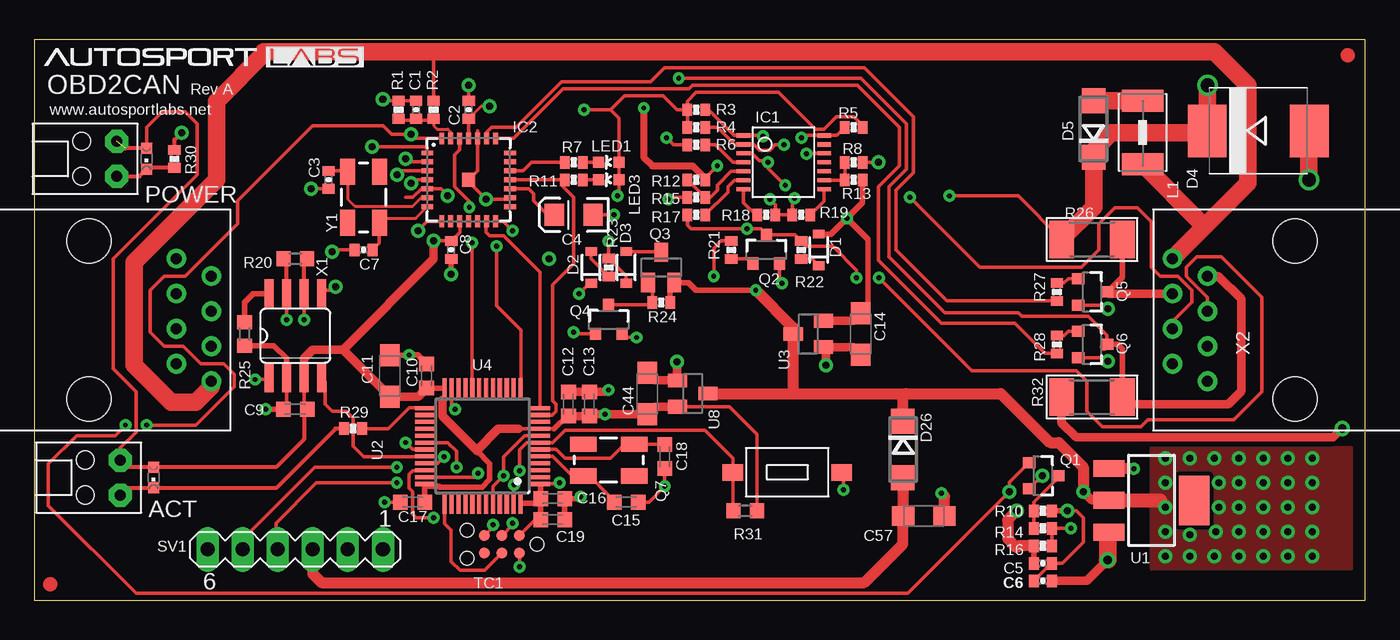
[diagram p8: board, top side]
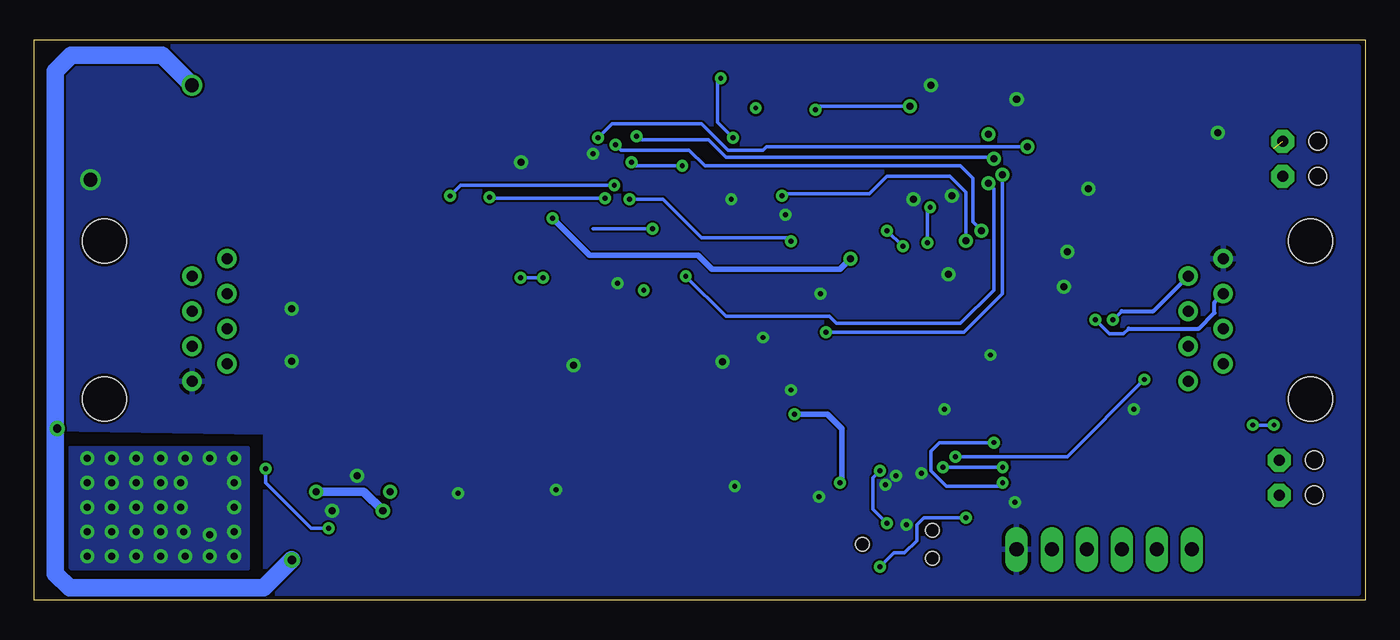
[diagram p9: board, bottom side, seen from below]

Size 96.52 x 40.64 mm. Coordinates in mm from the lower left corner, seen from the top.
Outline: 0,0 96.52,0 96.52,40.64 0,40.64 0,0
Copper layers (1*16): Top 0.035mm / dielectric 1.5mm / Bottom 0.035mm
Design rules "SparkFun *": minimum track width 8mil, minimum drill 14mil, track to track 6mil, track to pad 6mil, pad to pad 6mil, via to via 6mil, smd to smd 6mil, copper to edge 8mil, drill to drill 8mil, minimum pad ring 12mil, minimum via ring 10mil, stop-mask expansion 4mil, vias tented up to drill 20mil, thermal gap 10mil

### Footprints (pad centres in the part's own frame; a part is rotated, then mirrored left to right if it is on the bottom)
RIGHTANGLE_CML_5323F5 = drill 0.8 pad 1.676 octagon: A -1.27,1.651; C 1.27,1.651 | hole 1.295: 1.27,-0.889; -1.27,-0.889
CHIPLED_0603 = smd 0.8 x 0.8: A 0,-0.75; C 0,0.75
0402-CAP = smd 0.7 x 0.9: 1 -0.65,0; 2 0.65,0
EIA3216 = smd 1.4 x 1.6: A 1.4,0; C -1.4,0
C0603K = smd 1.05 x 1.08: 1 -0.875,0; 2 0.875,0
SMC_A = smd 1.6 x 1.4: + -1.5,0; - 1.5,0
SOD-323 = smd 0.63 x 0.83: 1 -1.15,0; 2 1.15,0
SMC = smd 2.8 x 3.8: A 3.7,0; C -3.7,0
SMA = smd 1.8 x 1.7: A 2.05,0; C -2.05,0
TSSOP-14 = smd 0.305 x 0.991: 1 -1.95,-2.925; 2 -1.3,-2.925; 3 -0.65,-2.925; 4 0,-2.925; 5 0.65,-2.925; 6 1.3,-2.925; 7 1.95,-2.925; 8 1.95,2.925; 9 1.3,2.925; 10 0.65,2.925; 11 0,2.925; 12 -0.65,2.925; 13 -1.3,2.925; 14 -1.95,2.925
_STN_SCANTOOL_QFN-28-S = smd 0.85 x 0.35: 1 -3,1.95; 2 -3,1.3; 3 -3,0.65; 4 -3,0; 5 -3,-0.65; 6 -3,-1.3; 7 -3,-1.95; 15 3,-1.95; 16 3,-1.3; 17 3,-0.65; 18 3,0; 19 3,0.65; 20 3,1.3; 21 3,1.95 | smd 0.35 x 0.85: 8 -1.95,-3; 9 -1.3,-3; 10 -0.65,-3; 11 0,-3; 12 0.65,-3; 13 1.3,-3; 14 1.95,-3; 22 1.95,3; 23 1.3,3; 24 0.65,3; 25 0,3; 26 -0.65,3; 27 -1.3,3; 28 -1.95,3 | smd 1 x 1: EXP 0,0
1812 = smd 1.6 x 3: 1 -2.3,0; 2 2.3,0
LED-0603 = smd 0.8 x 0.8: A 0,-0.75; C 0,0.75
SOT23-3 = smd 0.8 x 0.9: 1 -0.95,-1; 2 0.95,-1; 3 0,1.1
SOT23 = smd 1 x 1.4: 1 -0.95,-1.1; 2 0.95,-1.1; 3 0,1.1
CRYSTAL-SMD-5X3 = smd 1.9 x 1.1: 1 -1.85,-1.15; 2 1.85,-1.15; 3 1.85,1.15; 4 -1.85,1.15
0402-RES = smd 0.7 x 0.9: 1 -0.65,0; 2 0.65,0
R0603 = smd 1 x 1.1: 1 -0.85,0; 2 0.85,0
2010 = smd 1.8 x 2.7: 1 -2.2,0; 2 2.2,0
MA06-1 = drill 1.016 long: 1 -6.35,0; 2 -3.81,0; 3 -1.27,0; 4 1.27,0; 5 3.81,0; 6 6.35,0
TACT_6X3.5 = smd 1.5 x 1.2: P$1 -3.95,0; P$2 3.95,0
TC2030-IDC-NL = smd 0.787 x 0.787: 1 -1.27,-0.635; 2 -1.27,0.635; 3 0,-0.635; 4 0,0.635; 5 1.27,-0.635; 6 1.27,0.635 | hole 0.991: -2.54,0; 2.54,1.016; 2.54,-1.016
SOT223 = smd 1.219 x 2.235: 1 -2.311,-3.099; 2 0,-3.099; 3 2.311,-3.099 | smd 3.6 x 2.2: 4 0,3.099
SO08 = smd 0.66 x 2.032: 1 -1.905,-3.073; 2 -0.635,-3.073; 3 0.635,-3.073; 4 1.905,-3.073; 5 1.905,3.073; 6 0.635,3.073; 7 -0.635,3.073; 8 -1.905,3.073
SOT-23 = smd 1 x 1.4: 1 -0.95,-1.1; 2 0.95,-1.1; 3 0,1.1
LQFP48 = smd 1.5 x 0.3: 1 -4.15,2.75; 2 -4.15,2.25; 3 -4.15,1.75; 4 -4.15,1.25; 5 -4.15,0.75; 6 -4.15,0.25; 7 -4.15,-0.25; 8 -4.15,-0.75; 9 -4.15,-1.25; 10 -4.15,-1.75; 11 -4.15,-2.25; 12 -4.15,-2.75; 25 4.15,-2.75; 26 4.15,-2.25; 27 4.15,-1.75; 28 4.15,-1.25; 29 4.15,-0.75; 30 4.15,-0.25; 31 4.15,0.25; 32 4.15,0.75; 33 4.15,1.25; 34 4.15,1.75; 35 4.15,2.25; 36 4.15,2.75 | smd 0.3 x 1.5: 13 -2.75,-4.15; 14 -2.25,-4.15; 15 -1.75,-4.15; 16 -1.25,-4.15; 17 -0.75,-4.15; 18 -0.25,-4.15; 19 0.25,-4.15; 20 0.75,-4.15; 21 1.25,-4.15; 22 1.75,-4.15; 23 2.25,-4.15; 24 2.75,-4.15; 37 2.75,4.15; 38 2.25,4.15; 39 1.75,4.15; 40 1.25,4.15; 41 0.75,4.15; 42 0.25,4.15; 43 -0.25,4.15; 44 -0.75,4.15; 45 -1.25,4.15; 46 -1.75,4.15; 47 -2.25,4.15; 48 -2.75,4.15
RJ45_RIGHT_ANGLE_MOLEX_95001-2881 = drill 0.8 pad 1.422: P1 -4.445,6.35; P2 -3.175,8.89; P3 -1.905,6.35; P4 -0.635,8.89; P5 0.635,6.35; P6 1.905,8.89; P7 3.175,6.35; P8 4.445,8.89 | hole 3.2: -5.715,0; 5.715,0

### Placement (x,y rotation side)
ACT  4.57,8.89 270 top
ACT_S  8.64,8.89 180 top
C1  27.69,35.56 90 top
C2  31.5,35.56 90 top
C3  21.34,30.48 270 top
C4  39.12,27.94 180 top
C5  73.15,2.67 0 top
C6  73.15,1.4 180 top
C7  23.88,25.4 180 top
C8  30.23,25.4 270 top
C9  18.92,13.84 180 top
C10  28.45,16.26 90 top
C11  25.78,16.26 90 top
C12  38.73,14.22 90 top
C13  40.26,14.22 90 top
C14  59.94,19.3 270 top
C15  42.93,7.11 180 top
C16  37.59,7.37 0 top
C17  27.43,7.11 180 top
C18  45.72,10.41 90 top
C19  37.59,5.84 0 top
C44  44.45,14.99 90 top
C57  64.52,6.1 0 top
D1  56.9,25.4 90 top
D2  40.39,24.13 90 top
D3  42.93,24.13 90 top
D4  88.77,34.04 0 top
D5  76.83,34.16 90 top
D26  62.99,10.92 270 top
IC1  54.36,31.75 270 top
IC2  31.5,30.48 0 top
L1  80.39,33.91 270 top
LED1  41.66,31.75 90 top
LED3  41.66,30.48 90 top
POWER  4.32,32 270 top
POWER_S  8.13,32 180 top
Q1  73.15,9.02 270 top
Q2  53.09,25.4 0 top
Q3  45.47,24.13 0 top
Q4  41.66,20.32 0 top
Q5  76.71,22.35 270 top
Q6  76.71,18.54 270 top
Q7  41.66,10.16 0 top
R1  26.42,35.56 270 top
R2  28.96,35.56 90 top
R3  48.01,35.56 180 top
R4  48.01,34.29 180 top
R5  59.44,34.29 0 top
R6  48.01,33.02 0 top
R7  39.12,31.75 0 top
R8  59.44,31.75 180 top
R10  73.15,6.48 180 top
R11  39.12,30.48 180 top
R12  48.01,30.48 180 top
R13  59.44,30.48 0 top
R14  73.15,5.21 0 top
R15  48.01,29.21 180 top
R16  73.15,3.94 0 top
R17  48.01,27.94 0 top
R18  53.09,27.94 180 top
R19  55.63,27.94 0 top
R20  18.92,24.77 0 top
R21  50.55,25.4 270 top
R22  55.63,25.4 90 top
R23  41.66,24.13 270 top
R24  45.47,21.59 180 top
R25  15.24,19.3 90 top
R26  76.71,26.16 0 top
R27  74.17,22.35 270 top
R28  74.17,18.54 270 top
R29  23.11,12.45 0 top
R30  10.16,32 90 top
R31  51.56,6.48 0 top
R32  76.71,14.73 0 top
SV1  18.92,3.68 180 top
SW1  54.61,9.27 0 top
TC1  33.91,4.06 180 top
U1  81.03,7.24 270 top
U2  18.92,19.18 0 top
U3  56.13,19.3 90 top
U4  32.51,11.18 180 top
U8  47.75,14.99 270 top
X1  3.94,20.32 270 top
X2  91.44,20.32 90 top
Y1  23.88,29.21 90 top

### Tracks (layer width: path | path; a pad name or v marks a point on that pad's centre or on a via)
5V  (via drill 0.36, 0.51)
  Top 0.254: 60.07,30.35 60.09,30.37 R13.2 60.33,30.48 | C14.+ 59.39,20.25
  Top 0.381: D1.2 57.79,26.55 v58.93,27.69 60.07,28.83 60.07,30.35
  Top 0.406: v58.93,27.69 60.45,26.16 60.45,21.31 C14.+
  Top 0.61: 59.39,20.25 U3.2
  Bottom 0.254: 56.13,25.02 56.26,25.02 | v37.32,24.75 37.34,24.77
  Bottom 0.381: 56.13,25.02 48.39,25.02 47.37,24 38.1,24 37.34,24.77 | 56.26,25.02 v58.93,27.69
!ISO_K_TX
  Top 0.254: IC2.22 34.75,33.48 38.35,37.08 47.5,37.08 47.75,37.34 59.69,37.34 62.74,34.29 62.74,31.5 61.21,29.97 61.21,24.64 65.79,20.07 71.12,20.07 73.29,17.89 R28.2
!ISO_L_TX
  Top 0.254: IC2.23 32.8,33.94 33.15,34.29 34.92,34.29 38.23,37.59 44.7,37.59 45.72,38.61 60.2,38.61 63.75,35.05 63.75,30.99 62.48,29.72 62.48,25.4 66.18,21.7 R27.2
!ISO_RX  (via drill 0.36, 0.51)
  Top 0.254: R4.1 49.53,34.29 50.77,33.05 IC1.2 52.17,33.05 52.58,32.64 53.34,32.64 53.72,33.02 v54.36,33.02 | IC2.8 28.5,27.48 v27.81,26.8
  Bottom 0.254: v54.36,33.02 53.98,32.64 49.02,32.64 47.88,31.5 29.34,31.5 28.45,30.61 28.45,27.43 v27.81,26.8
!OBD_RX_STATUS!/PGC
  Top 0.254: IC2.19 35.45,31.13 36.07,31.75 R7.1
!VPW_RX  (via drill 0.36, 0.51)
  Top 0.254: v55.63,33.53 55.8,33.7 IC1.14 58.21,33.7 58.79,34.27 R5.1 | IC2.1 28.5,32.72 28.32,32.89 v24.51,32.89
  Bottom 0.254: v55.63,33.53 54.61,34.54 48.13,34.54 46.23,32.64 43.69,32.64 43.43,32.89 v24.51,32.89
+12V
  Top 0.254: R2.2 28.96,39.75
  Top 1.27: 16.76,39.75 28.96,39.75 85.6,39.75 88.01,37.34 88.01,30.23 85.09,27.3 | 16.76,39.75 16.64,39.75 | X1.P8 12.83,15.49 11.68,14.35 9.91,14.35 7.24,17.02 7.24,24.51 13.21,30.48 13.21,36.2 16.76,39.75 | X2.P8 85.09,27.3 | L1.2 84.69,27.3 85.09,27.3
BATT_V
  Top 0.203: IC2.27 30.2,33.94 29.97,34.16 29.21,34.16 28.96,34.42 R2.1
  Top 0.254: R1.2 26.53,34.8 27.69,34.8 C1.1 27.8,34.8 28.84,34.8 R2.1
CAN_RX
  Top 0.254: U2.4 21.08,15.85 21.08,14.22 21.59,13.72 22.61,13.72 23.11,13.21 23.11,11.18 23.88,10.41 28.35,10.41 U4.32
CAN_TX  (via drill 0.36)
  Top 0.254: U2.1 16.92,16 v16,16 | v29.72,10.41 29.23,9.93 U4.33
  Bottom 0.254: v16,16 21.59,10.41 v29.72,10.41
CANH  (via drill 0.36)
  Top 0.254: v18.29,20.32 U2.7
  Top 0.305: U2.7 18.29,25.06
  Top 0.406: 18.29,25.06 R20.1 18.07,24.89
  Bottom 0.254: 17.65,20.95 v18.29,20.32
  Bottom 0.305: 17.65,20.95 15.37,20.95 X1.P2
CANL  (via drill 0.36)
  Top 0.254: v19.56,20.32 19.56,22.86
  Top 0.305: U2.6 19.56,22.86 19.56,24.73 19.56,25.06
  Top 0.406: 19.56,25.06 R20.2 19.56,24.73
  Bottom 0.254: v19.56,20.32 18.54,19.3 17.53,19.3 17.14,19.68
  Bottom 0.305: 17.14,19.68 12.06,19.68 10.92,20.83 10.92,21.59 X1.P3
GND  (via drill 0.36, 0.51, 1)
  Top 0.254: C6.2 73.77,2.67 C5.2 74.55,2.67 76.07,4.19 76.07,5.97 75.56,6.48 v74.93,6.48 | 32.15,34.05 IC2.24 32.15,31.13 IC2.EXP 31.5,30.35 v32.77,29.08 34.4,29.08 IC2.16 | 26.92,29.21 27.43,29.21 28.07,29.84 28.45,29.84 28.46,29.83 IC2.5 29.48,29.83 v29.97,29.34 | U4.23 30.26,14.01 v30.5,13.84 | U4.44 33.26,8.24 v34.04,9.02 34.04,10.41 35.55,11.93 U4.8 | U4.47 34.76,8.35 v34.8,8.38 | C17.2 v25.4,7.11 | U2.2 18.29,14.08 C9.2 | v27.18,17.78 27.15,17.76 | SW1.P$2 58.67,9.16 v58.67,8 | C44.- 45,15.94 | U8.1 46.61,15.98 | C14.- 59.39,18.35 | U3.1 57.4,18.18 | Q5.2 77.56,21.4 v77.88,21.13 | Q6.2 77.35,17.59 v77.88,17.32 | 41.39,15.1 v41.66,15.24 | v43.69,19.05 42.88,19.05 Q4.2 | C7.2 21.72,25.4 v21.59,25.27 | 20.83,22.48 21.59,22.48 v21.84,22.73 | v20.07,29.84 21.32,29.84 C3.2 | v25.27,36.32 25.39,36.21 R1.1 C1.2 | C2.2 v31.5,37.34 | TC1.5 33.27,5.33 v33.27,5.46 | Q2.2 54.04,23.18 v54.23,22.99 | R15.2 46.1,29.21 v45.97,29.08 | C4.C v42.04,27.94 | D2.1 40.25,22.98 v39.5,22.23 | R8.1 v61.21,31.75 | IC1.12 56.02,32.4 v56.01,32.38 | C18.1 v45.72,8.26 44.58,7.11 C15.1 | Q1.2 v73.1,9.02 | U4.35 31.99,8.93 v32.18,9.2
  Top 0.305: R30.2 10.16,33.4 v10.67,33.91
  Top 0.381: R10.1 v74.93,6.48
  Top 0.406: v16.76,13.84 C9.2 | R25.1 17.36,18.45 18.29,17.53 U2.2 | U2.5 20.83,22.48 | v39.62,7.49 39.5,7.37 C16.2 C19.2 | C10.2 27.8,17.78 v27.18,17.78 | 27.15,17.76 C11.- | C8.2 v30.23,23.62
  Top 0.61: 45,15.94 U8.1 | 46.61,15.98 v46.61,17.27 | 59.39,18.35 U3.1 | 57.4,18.18 v57.4,17.02 | 41.39,15.1 C13.2 C12.2
  Top 0.813: C57.- 66.02,7.52 v65.79,7.75
  Top 1.27: D4.A 92.46,34.02 v92.46,30.48
  pour Bottom: 0.51,0.51 79.76,0.51 79.76,12.19 95.5,12.45 95.5,40.13 0.51,40.13
GND1
  Top 0.305: R29.1 21.84,12.45 17.53,8.13 8.65,8.13 | 8.65,8.13 ACT_S.C | 8.65,8.13 6.73,8.13 ACT.C
GND2
  Top 0.305: POWER.C 7.61,30.73 POWER_S.C 8.23,31.35 R30.1
J1850BUS+  (via drill 0.36)
  Top 0.254: D3.1 42.93,23.51 R23.1 v41.66,26.04 | v53.34,29.08 53.74,28.69 R18.1 R19.1 54.99,29.08 v55.12,29.16 | v63.5,29.21 68.58,24.13 75.95,24.13 77.22,25.4 77.22,27.3 78.36,28.45 80.01,28.45 81.03,27.43 81.03,24.13 81.66,23.5 82.93,23.5 83.95,22.48 83.95,21.59 82.55,20.19 X2.P4
  Bottom 0.254: v53.34,29.08 50.93,29.08 48.13,26.29 41.91,26.29 v41.66,26.04 | v55.12,29.16 63.3,29.16 v63.5,29.21
J1850BUS+_TX  (via drill 0.36, 0.51)
  Top 0.254: Q4.1 39.23,19.32 v39.12,19.43 | IC2.3 26.56,31.13 v26.29,30.86
  Bottom 0.254: v39.12,19.43 29.08,19.43 26.29,22.23 v26.29,30.86
J1850BUS-  (via drill 0.36)
  Top 0.254: R17.1 47.36,27.19 47.62,26.92 v51.69,26.92 52.7,26.92 53.09,26.54 Q2.3 55.16,26.5 55.61,26.05 R22.2 56.02,25.65 57.91,25.65 59.64,23.93 v59.64,23.37 | X2.P5 85.09,21.97 83.57,23.5 83.57,24.13 84.33,24.89 86.11,24.89 89.03,21.97 89.03,15.11 87,13.08 80.77,13.08 80.26,12.57 77.47,12.57 76.33,13.72 76.33,15.88 75.56,16.64 68,16.64 v61.27,23.37
  Bottom 0.254: v51.69,26.92 56.01,26.92 | v61.27,23.37 v59.64,23.37
J1850BUS-_TX  (via drill 0.36, 0.51)
  Top 0.254: IC2.4 27.56,30.48 v27.3,30.23 | R21.1 49.8,26.05 49.28,25.53 v49.28,23.5
  Bottom 0.254: v49.28,23.5 46.35,20.57 38.86,20.57 38.35,20.07 29.34,20.07 26.92,22.48 26.92,29.84 v27.3,30.23
K-LINE  (via drill 0.36)
  Top 0.254: 77.85,18.54 Q6.3 77.81,19.22 76.45,20.57 71.63,20.57 71.37,20.83 66.04,20.83 61.98,24.89 61.98,29.97 63.25,31.24 63.25,34.54 59.94,37.85 v46.74,37.85 | R6.1 46.35,33.02 v45.85,33.53
  Top 0.381: R32.2 78.91,18.25 78.61,18.54 77.85,18.54
  Top 0.61: X2.P7 85.88,23.5 87.53,21.84 87.53,15.14 86.61,14.22 79.42,14.22 R32.2 | Q6.3 77.72,18.54 77.57,18.39
  Bottom 0.254: v46.74,37.85 46.99,37.59 46.99,34.65 46.86,34.54 v45.85,33.53
L-LINE
  Top 0.381: Q5.3 77.85,22.35 78.91,23.41 R26.2
  Top 0.61: X2.P6 77.94,22.23 Q5.3
N$1
  Top 0.254: R18.2 52.32,27.94 51.43,28.83 IC1.7
N$3
  Top 0.254: R17.2 50.29,29.58 50.29,29.97 50.77,30.45 IC1.6
N$4
  Top 0.254: Q6.1 74.99,19.49 74.69,19.19 R28.1
N$5
  Top 0.254: Q5.1 74.99,23.3 74.69,23 R27.1
N$6
  Top 0.254: IC1.5 50.53,31.1 49.53,30.1 49.53,29.72 49.02,29.21 R15.1 47.64,30.23 47.37,30.23 47.37,30.46 R12.2
N$7
  Top 0.254: IC1.8 57.28,28.94 R19.2
N$8  (via drill 0.36)
  Top 0.254: R16.2 73.8,5.19 73.79,5.21 R14.2 v75.18,5.21
  Top 0.813: U1.1 79.73,9.55 v79.76,9.53
  Bottom 0.254: v79.76,9.53 79.76,8.51 76.45,5.21 v75.18,5.21
N$9
  Top 0.254: Q3.3 45.42,25.27 D3.2
N$11
  Top 0.254: U4.25 28.32,13.97 27.18,13.97 25.65,12.45 R29.2
N$12
  Top 0.254: R8.2 58.8,31.73 58.8,30.5 R13.1 58.8,30.48 58.77,30.45 IC1.9
N$13
  Top 0.254: R6.2 49.4,33.02 50.67,31.75 IC1.4
N$14
  Top 0.254: D1.1 56.4,24.75 R22.1
N$15
  Top 0.406: R25.2 15.24,21.59 15.88,22.23 16.99,22.23 U2.8
N$18
  Top 0.254: Q3.1 44.49,23.03 44.45,22.99 44.82,22.62 R24.2 44.7,21.59 44.53,21.42 Q4.3
N$22
  Top 0.254: Q1.3 74.25,8.85 72.5,7.1 R10.2 72.52,6.48 72.5,6.46 R14.1
N$24
  Top 0.254: R23.2 40.39,24.75 D2.2
N$25
  Top 0.254: Q2.1 52.09,24.4 52.07,24.38 51.7,24.75 R21.2
N$26
  Top 0.254: IC2.17 35.83,29.83 36.2,29.46 36.2,28.96 37.21,27.94 C4.A
N$30
  Top 0.254: R7.2 LED1.C
N$31
  Top 0.254: R11.1 LED3.C
N$40
  Top 0.254: U4.6 37.84,10.93 38.48,10.29 41.78,10.29 42.67,11.18 43.12,11.18 Q7.3 43.53,11.29 C18.2
N$42
  Top 0.254: U4.5 37.58,10.43 39,9.01 Q7.1 40.27,9.01 41.66,7.62 41.66,7.51 C15.2
N$50
  Top 1.27: D5.A L1.1
OSC1
  Top 0.203: IC2.6 28.04,29.18 27.43,28.57 23.24,28.57 22.73,29.09 22.73,29.6 | Y1.3 22.73,29.6 | 22.73,29.6 22.73,29.59
  Top 0.254: 22.73,30.86 22.73,30.87 Y1.3 22.66,31.06 22.59,31.13 C3.1
OSC2
  Top 0.203: IC2.7 27.65,27.69 25.4,27.69 25.02,27.3 | 25.03,27.31 Y1.1
  Top 0.254: 25.02,27.3 25.03,27.31 | 25.02,27.3 25.02,27.35 Y1.1 | C7.1 25.02,25.89 25.02,27.3
PWM/!VPW  (via drill 0.36, 0.51)
  Top 0.254: IC2.28 27.61,33.48 v27.3,33.78 25.91,33.78 25.27,34.42 20.19,34.42 14.73,28.96 14.73,27.3 10.92,23.5 9.4,23.5 8.38,22.48 8.38,19.43 9.4,18.41 10.79,18.41 12.06,17.14 13.72,17.14 14.48,16.38 14.48,15.49 11.68,12.7 v8.13,12.7 | Q1.1 70.74,8.55 v70.74,7.87 63.37,0.51 7.37,0.51 1.02,6.86 1.02,9.91 3.05,11.94 5.84,11.94 v6.6,12.7
  Bottom 0.254: v6.6,12.7 v8.13,12.7
PWM_RX  (via drill 0.36, 0.51)
  Top 0.254: IC2.2 27.08,31.78 26.92,31.94 v26.92,32 | 48.64,35.56 R3.1 48.9,35.56 50.76,33.7 IC1.1 52.79,33.7 v52.83,33.66
  Bottom 0.254: 52.58,33.4 v52.83,33.66 52.7,33.66 52.45,33.4 47.62,33.4 46.35,32.13 27.05,32.13 v26.92,32
RESET  (via drill 0.36)
  Top 0.254: R31.1 50.66,6.53 SW1.P$1 50.66,10.3 48.64,12.32 38.48,12.32 37.59,11.43 U4.7 35.69,11.43 35.18,10.92 v35.18,9.4 | v34.67,5.59 33.91,4.57 TC1.3
  Bottom 0.254: v35.18,9.4 35.69,8.89 35.69,6.6 v34.67,5.59
RESET_STN  (via drill 0.36)
  Top 0.254: U4.20 31.76,25.9 v31.75,25.91 | v31.55,28.5 31.55,28.91 30.48,29.97 30.48,32.31 30.84,32.66 30.84,33.47 IC2.26
  Bottom 0.254: v31.75,25.91 31.75,28.3 v31.55,28.5
RST_NVM
  Top 0.254: 38.48,30.48 R11.2 38.35,30.48 | IC2.18 38.35,30.48 | 38.35,30.48 38.35,29.97 39.12,29.21 39.12,24.38 37.59,22.86 37.59,14.48 37.85,14.22 37.85,13.72 37.56,13.43 U4.11
RX_FROM_STN  (via drill 0.36)
  Top 0.254: v34.67,26.8 33.99,27.48 IC2.14 | U4.13 35.31,15.37 35.31,19.56 33.53,21.34 v33.53,25.65
  Bottom 0.254: v33.53,25.65 v34.67,26.8
SAFE12V  (via drill 0.36, 0.6, 1)
  Top 0.254: R12.1 48.64,30.48 48.64,30.61 v49.53,31.5 | IC1.3 52.05,32.4 52.58,31.88 53.09,31.88 v53.21,31.75 53.21,31.32 v54.46,30.07 | R26.1 71.36,29.31 v66.37,29.31
  Top 0.381: 48.64,30.61 48.66,30.59 R12.1
  Top 0.508: v44.2,35.69 44.2,32.13 44.83,31.5 47.75,31.5 48.64,30.61
  Top 0.61: R32.1 74.51,12.87 75.56,11.81 94.23,11.81 v94.87,12.45 | v77.85,2.92 76.33,1.4 C6.1
  Top 1.27: R26.1 76.83,28.49 D5.C 76.83,32.64 78.11,33.91 84.95,33.91 D4.C 85.07,37.32 v85.09,37.34 | U1.3 77.85,4.85 v77.85,2.92
  Bottom 0.254: v49.53,31.5 52.96,31.5 v53.21,31.75 | v66.37,29.31 65.61,30.07 v54.46,30.07
  Bottom 0.61: v94.87,12.45 94.74,12.45 95,12.7
  Bottom 1.27: v77.85,2.92 79.88,0.89 93.98,0.89 95,1.91 95,12.7 95,38.35 93.85,39.5 87.25,39.5 v85.09,37.34
SWCLK
  Top 0.254: TC1.4 32.64,2.16 30.86,2.16 30.23,2.79 30.23,5.08 29.76,5.54 U4.37
SWDIO  (via drill 0.36)
  Top 0.254: v28.96,5.97 27.69,5.97 27.43,6.22 27.43,7.87 27.18,8.13 27.18,9.14 27.43,9.4 28.33,9.4 U4.34 | v35.18,2.41 TC1.2
  Bottom 0.254: v28.96,5.97 32,5.97 32.51,5.46 32.51,4.32 33.4,3.43 34.16,3.43 v35.18,2.41
TX_TO_STN
  Top 0.254: U4.12 36.66,23.79 34.04,26.42 33.02,26.42 32.77,26.67 32.77,27.45 IC2.13
USART1_RX  (via drill 0.36)
  Top 0.254: U4.31 27.43,10.93 v26.92,11.43 | v26.29,8.51 20.45,8.51 17.53,5.59 17.53,3.81 SV1.4
  Bottom 0.254: v26.92,11.43 30.86,11.43 31.5,10.79 31.5,9.4 30.35,8.26 26.54,8.26 v26.29,8.51
USART1_TX  (via drill 0.36)
  Top 0.254: U4.30 29.97,11.43 30.61,10.79 v30.61,9.65 | v26.29,9.65 20.32,9.65 15.24,4.57 15.24,3.81 SV1.5
  Bottom 0.254: v30.61,9.65 v26.29,9.65
V+  (via drill 0.36, 0.51)  (1 unrouted)
  Top 0.203: C2.1 32.4,35.81 v33.02,35.81
  Top 0.254: LED1.A 42.41,31.86 42.42,31.88 42.41,31.89 | LED3.A 42.41,30.49 LED3.A | 31.5,34.92 C2.1 IC2.25 | IC2.10 30.86,27.46 30.86,26.68 C8.1 v28.96,26.05 28.96,26.04 | R3.2 47.37,35.55 47.37,34.3 R4.2 47.24,34.29 | R3.2 47.36,36.18 48.01,36.83 53.98,36.83 56.64,34.16 57.28,34.16 58.17,35.05 59.44,35.05 60.09,34.4 R5.2 | LED3.A 42.41,29.45 v42.29,29.34 | LED1.A 42.41,31.64 42.42,31.62 42.41,31.61 LED3.A | R3.2 46.61,35.56 45.59,36.58 42.8,36.58 41.78,35.56 | 41.78,35.56 v39.88,35.56 | 41.78,35.56 42.41,34.94 LED1.A | 29.71,15.38 U4.24 29.74,15.31 29.74,14.35 29.59,14.53 | 36.72,8.37 U4.1 37.89,8.43 v38.1,8.51 | 36.38,7.03 C16.1 | U2.3 19.56,14.08 C9.1 | 28.31,8.37 U4.36 28.53,8.26 | C44.+ 45,14.04 | C19.1 36.32,5.84 TC1.1 | R31.2 52.41,12.04 50.42,14.04 U8.2 | 32.13,10.79 32.13,10.92 | 29.34,8.26 29.39,8.2 | 37.69,12.42 U4.9 35.11,12.43 35.1,12.42 | 35.36,7.01 35.28,7.01 U4.48 | ACT.A 6.22,11.05 7.37,12.19 7.37,15.11 5.71,16.76 5.71,24.77 11.81,30.86 11.81,34.54 10.92,35.43 9.27,35.43 8.13,34.29 POWER_S.A
  Top 0.305: ACT.A 6.74,9.64 ACT_S.A 8.65,9.65 17.53,9.65 19.56,11.68 19.56,14.08 | POWER_S.A 6.62,32.75
  Top 0.406: C10.1 29.71,15.38 | C19.1 C16.1 36.72,8.37 | 28.31,8.37 C17.1 | 28.53,8.26 29.34,8.26 | 29.39,8.2 32.46,8.2 33.02,8.76 33.02,9.91 32.13,10.79 | C12.1 38.62,13.35 37.69,12.42 | 36.38,7.03 35.35,7.03 35.36,7.01
  Top 0.61: C12.1 C13.1 40.4,13.49 v41.4,13.49 C44.+ | 45,14.04 U8.2 | 22.38,18.16 C11.+ 27.82,14.76 C10.1 | 22.38,18.16 20.19,18.16 19.56,17.53 U2.3 | 22.38,18.16 28.96,24.74 v28.96,26.05 | 32.13,10.79 29.59,13.34 29.59,14.53 | 35.1,12.42 33.63,12.42 32.13,10.92
  Bottom 0.254: v39.88,35.56 39.62,35.81 v33.02,35.81 | v42.29,29.34 42.16,29.46 35.94,29.46 34.67,30.73 30.1,30.73 28.96,29.59 v28.96,26.05 | v38.1,8.51 37.94,8.54
  Bottom 0.406: 37.94,8.54 37.94,12.43 39,13.49 v41.4,13.49
VBUS
  Top 0.813: D26.A 62.99,6.12 C57.+ 62.99,6.07 62.99,4.06 60.2,1.27 20.83,1.27 20.19,1.91 SV1.3
VCC  (via drill 0.36, 0.51)
  Top 0.254: 72.39,3.94 R16.1 72.5,3.83 72.52,3.81 72.5,3.79 | Q3.2 46.4,23.03 46.12,22.75
  Top 0.381: 72.5,3.79 C5.1 | 46.12,22.75 R24.1 | v52.32,22.48 48.01,22.48 47.45,23.03 Q3.2
  Top 0.61: U1.2 76.71,7.24 v76.07,7.87
  Top 0.813: v52.32,22.48 55.03,19.77 U3.3 55.03,15.16 54.86,14.99 | U8.3 54.86,14.99 | v71.25,6.48 70.6,5.83 70.6,4.46 71.25,3.81 71.37,3.94 72.39,3.94 | 54.86,14.99 63.25,14.99 | 63.25,14.99 70.1,14.99 73.66,11.43 74.3,11.43 76.07,9.65 v76.07,7.87 | D26.C 62.99,14.73 63.25,14.99
  Top 1.016: U1.2 81.66,7.24
  Bottom 0.61: v71.25,6.48 72.64,7.87 v76.07,7.87
  other vias: 83.82,3.17 85.6,3.17 82.04,8.51 82.04,4.95 82.04,6.73 82.04,10.29 82.04,3.17 87.38,3.17 87.38,4.95 85.7,4.95 83.82,4.75 87.38,6.73 85.9,6.73 87.38,8.51 85.9,8.51 85.6,10.29 87.38,10.29 83.82,10.29 89.15,10.29 89.15,8.51 89.15,6.73 89.15,4.95 89.15,3.17 90.93,3.17 90.93,4.95 90.93,6.73 90.93,8.51 90.93,10.29 92.71,10.29 92.71,8.51 92.71,6.73 92.71,4.95 92.71,3.17
  pour Bottom (isolate 0.305): 81.03,11.05 93.98,11.05 93.98,2.29 81.03,2.29
  pour Top (isolate 0.305, no thermals): 81.03,11.05 95.5,11.05 95.5,2.29 81.03,2.29
(copper drawn outside any net)
  shapes: Top circle x2

### Text on the board
tPlace: OBD2CAN | Rev A | www.autosportlabs.net